# EAGLE design Artembed (EAGLE 9.5.2)
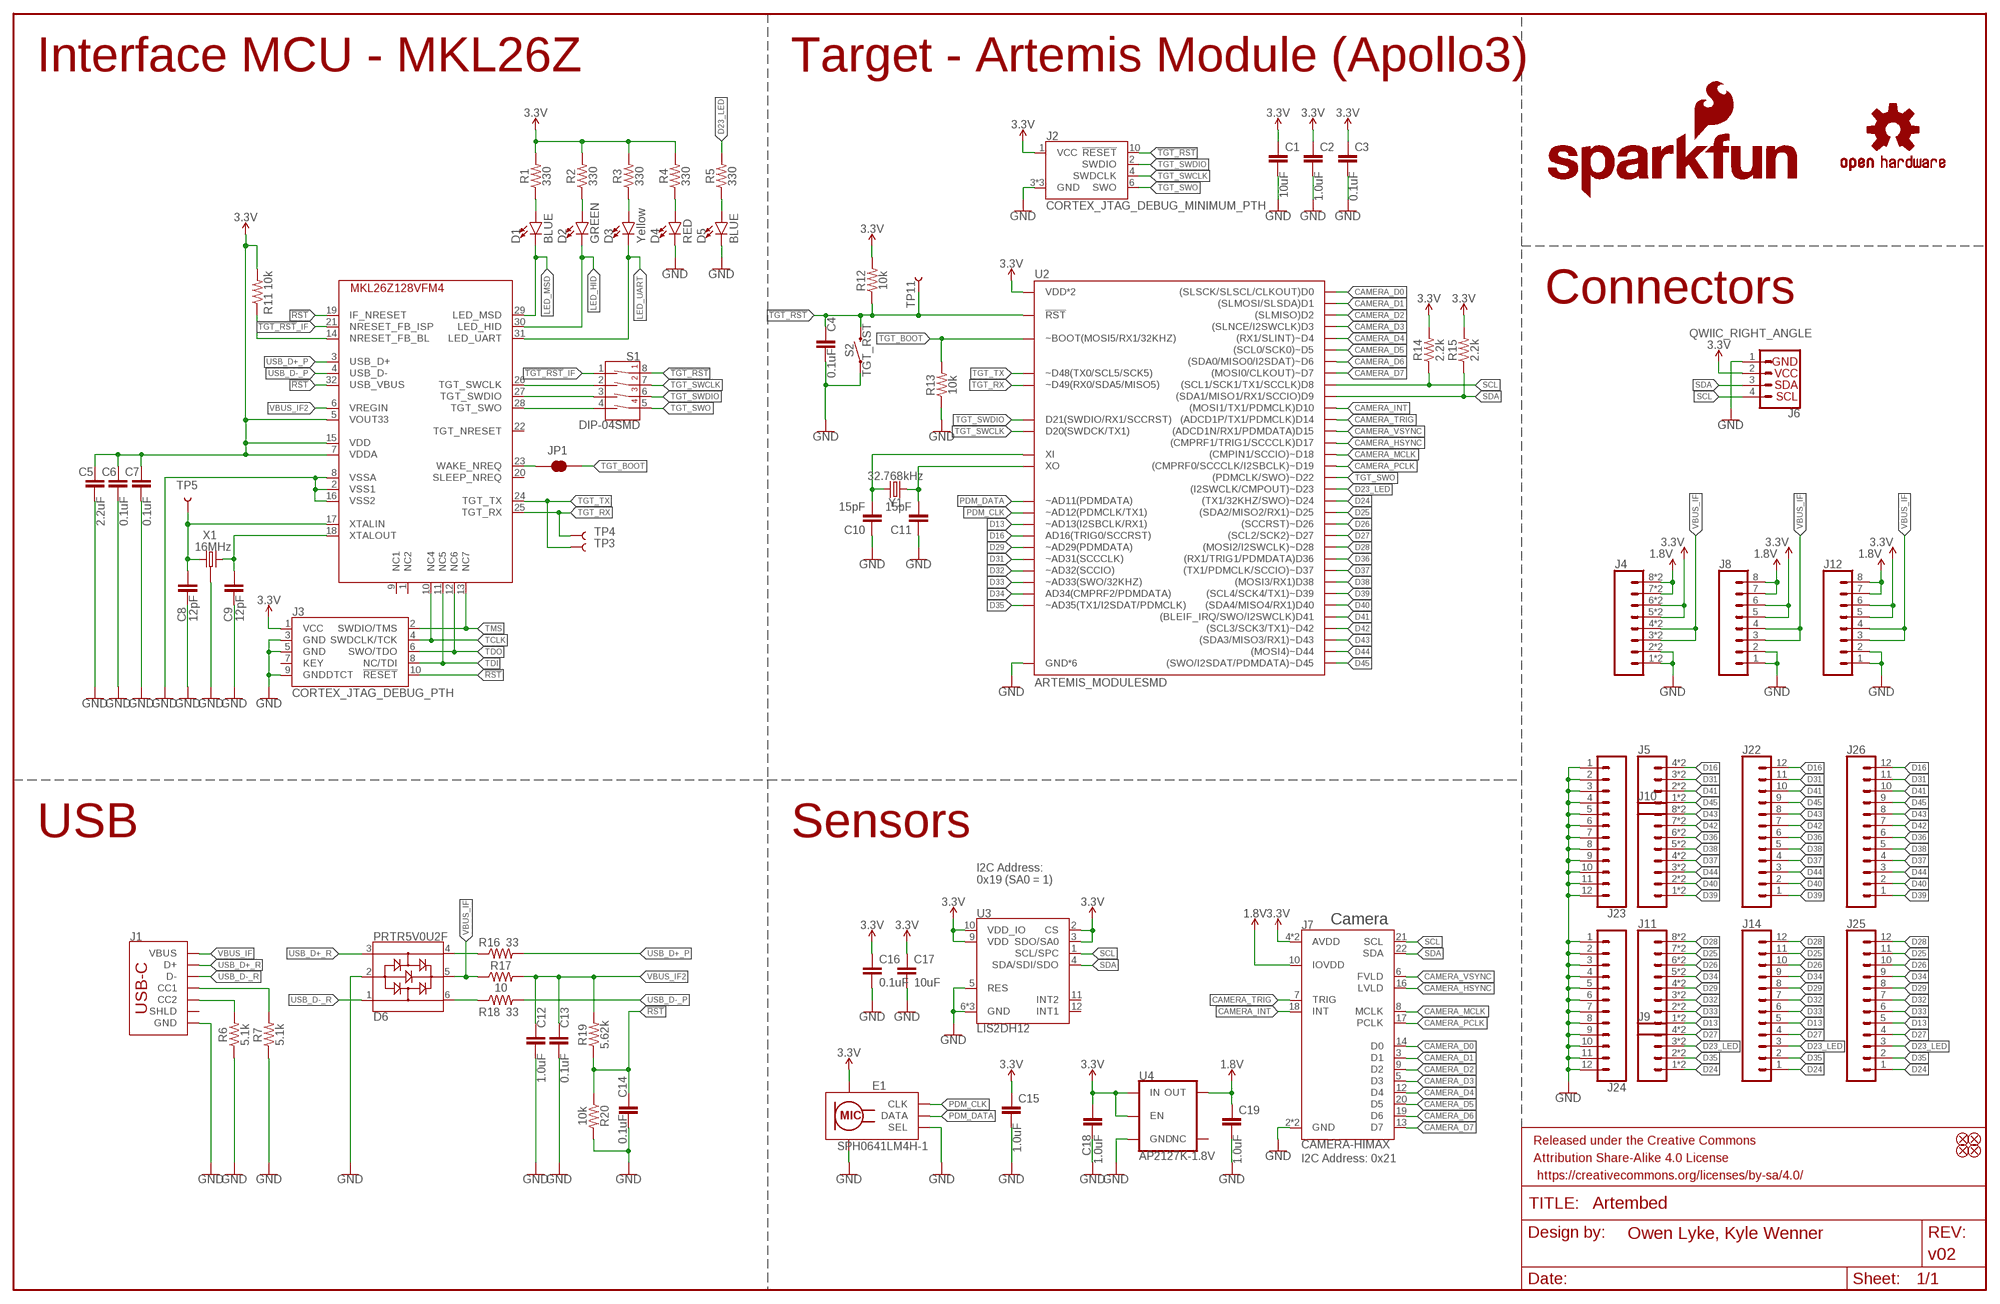
[diagram p0: schematic, sheet 1]

## Parts
C1  10uF  10UF-0603-6.3V-20%  [0603]
C2  1.0uF  1.0UF-0603-16V-10%  [0603]
C3  0.1uF  0.1UF-0603-25V-5%  [0603]
C4  0.1uF  0.1UF-0603-25V-5%  [0603]
C5  2.2uF  2.2UF-0603-10V-20%  [0603]
C6  0.1uF  0.1UF-0603-25V-5%  [0603]
C7  0.1uF  0.1UF-0603-25V-5%  [0603]
C8  12pF  12PF-0603-50V-5%  [0603]
C9  12pF  12PF-0603-50V-5%  [0603]
C10  15pF  15PF-0603-50V-5%  [0603]
C11  15pF  15PF-0603-50V-5%  [0603]
C12  1.0uF  1.0UF-0603-16V-10%  [0603]
C13  0.1uF  0.1UF-0603-25V-5%  [0603]
C14  0.1uF  0.1UF-0603-25V-5%  [0603]
C15  1.0uF  1.0UF-0603-16V-10%  [0603]
C16  0.1uF  0.1UF-0603-25V-5%  [0603]
C17  10uF  10UF-0603-6.3V-20%  [0603]
C18  1.0uF  1.0UF-0603-16V-10%  [0603]
C19  1.0uF  1.0UF-0603-16V-10%  [0603]
D1  BLUE  LED-BLUE0603  [LED-0603]
D2  GREEN  LED-GREEN0603  [LED-0603]
D3  Yellow  LED-YELLOW0603  [LED-0603]
D4  RED  LED-RED0603  [LED-0603]
D5  BLUE  LED-BLUE0603  [LED-0603]
D6  PRTR5V0U2F  [SOT886]
E1  SPH0641LM4H-1  SPH0641LM4H-1_MICROPHONE  [SPH0641LM4H-1_MICROPHONE]
FD1  FIDUCIAL1X2  [FIDUCIAL-1X2]
FD2  FIDUCIAL1X2  [FIDUCIAL-1X2]
FD3  FIDUCIAL1X2  [FIDUCIAL-1X2]
FD4  FIDUCIAL1X2  [FIDUCIAL-1X2]
FRAME1  FRAME-LEDGER  [CREATIVE_COMMONS]
J1  USB_C2-LAYER  [USB-C-16P]
J2  CORTEX_JTAG_DEBUG_MINIMUM_PTH  [2X5-PTH-1.27MM]
J3  CORTEX_JTAG_DEBUG_PTH  [2X5-PTH-1.27MM]
J4  CONN_08SMD-COMBO-FEMALE  [1X08_SMD_COMBINED]
J5  1X04_SMD_STRAIGHT_COMBO  CONN_04SMD_STRAIGHT_COMBO  [1X04_SMD_VERTICAL_COMBO]
J6  QWIIC_RIGHT_ANGLE  QWIIC_CONNECTORJS-1MM  [JST04_1MM_RA]
J7  CAMERA-HIMAX  [FPC-24-AMPHENOL-SFV24R-1STE1HLF]
J8  CONN_08NO_SILK_FEMALE_PTH  [1X08_NO_SILK]
J9  1X04_SMD_STRAIGHT_COMBO  CONN_04SMD_STRAIGHT_COMBO  [1X04_SMD_VERTICAL_COMBO]
J10  CONN_08SMD-COMBO-FEMALE  [1X08_SMD_COMBINED]
J11  CONN_08SMD-COMBO-FEMALE  [1X08_SMD_COMBINED]
J12  CONN_08NO_SILK_FEMALE_PTH  [1X08_NO_SILK]
J14  CONN_12NO_SILK  [1X12_NO_SILK]
J22  CONN_12NO_SILK  [1X12_NO_SILK]
J23  CONN_12NO_SILK  [1X12_NO_SILK]
J24  CONN_12NO_SILK  [1X12_NO_SILK]
J25  CONN_12NO_SILK  [1X12_NO_SILK]
J26  CONN_12NO_SILK  [1X12_NO_SILK]
JP1  JUMPER-SMT_2_NC_TRACE_SILK  [SMT-JUMPER_2_NC_TRACE_SILK]
LOGO1  OSHW-LOGOS  [OSHW-LOGO-S]
LOGO2  SFE_LOGO_NAME_FLAME.2_INCH  [SFE_LOGO_NAME_FLAME_.2]
R1  330  330OHM-0603-1/10W-1%  [0603]
R2  330  330OHM-0603-1/10W-1%  [0603]
R3  330  330OHM-0603-1/10W-1%  [0603]
R4  330  330OHM-0603-1/10W-1%  [0603]
R5  330  330OHM-0603-1/10W-1%  [0603]
R6  5.1k  5.1KOHM5.1KOHM-0603-1/10W-1%  [0603]
R7  5.1k  5.1KOHM5.1KOHM-0603-1/10W-1%  [0603]
R11  10k  10KOHM-0603-1/10W-1%  [0603]
R12  10k  10KOHM-0603-1/10W-1%  [0603]
R13  10k  10KOHM-0603-1/10W-1%  [0603]
R14  2.2k  2.2KOHM-0603-1/10W-1%  [0603]
R15  2.2k  2.2KOHM-0603-1/10W-1%  [0603]
R16  33  33OHM-0603-1/10W-1%  [0603]
R17  10  10OHM-0603-1/10W-1%  [0603]
R18  33  33OHM-0603-1/10W-1%  [0603]
R19  5.62k  5.62KOHM-0603-1/10W-1%  [0603]
R20  10k  10KOHM-0603-1/10W-1%  [0603]
S1  DIP-04SMD  [DIPSWITCH-04-SMD]
S2  TGT_RST  MOMENTARY-SWITCH-SPST-SMD-4.6X2.8MM  [TACTILE_SWITCH_SMD_4.6X2.8MM]
TP3  TEST-POINT3X5  [PAD.03X.05]
TP4  TEST-POINT3X5  [PAD.03X.05]
TP5  TEST-POINT3X5  [PAD.03X.05]
TP11  TEST-POINT3X5  [PAD.03X.05]
U1  DAPLINK_KL26Z  [QFN-32-NOPAD]
U2  ARTEMIS_MODULESMD  [ARTEMIS_FP]
U3  LIS2DH12  [LGA-12-LISDH12]
U4  AP2127K-1.8V  V_REG_AP2127K-1.8V  [SOT23-5]
X1  16MHz  CRYSTAL-16MHZ_SMALL  [CRYSTAL-SMD-2X2.5MM]
Y1  32.768kHz  CRYSTAL-32.768KHZSMD-3.2X1.5  [CRYSTAL-SMD-3.2X1.5MM]

## Nets
1.8V: C19.1 J4.7 J4.7@2 J4.8 J4.8@2 J7.10(IOVDD) J8.7 J8.8 J12.7 J12.8 U4.5(OUT)
3.3V: C1.1 C2.1 C3.1 C5.1 C6.1 C7.1 C15.1 C16.1 C17.1 C18.1 E1.5(VDD) J2.1(VCC) J3.1(VCC) J4.5 J4.5@2 J4.6 J4.6@2 J6.2 J7.4(AVDD) J7.11(AVDD) J8.5 J8.6 J12.5 J12.6 R1.2 R2.2 R3.2 R4.2 R11.2 R12.2 R14.2 R15.2 U1.5(VOUT33) U1.7(VDDA) U1.15(VDD) U2.VDD@36(VDD*2) U2.VDD@37(VDD*2) U3.2(CS) U3.3(SDO/SA0) U3.9(VDD) U3.10(VDD_IO) U4.1(IN) U4.3(EN)
!RST: C14.1 J3.10(!RESET) R19.1 R20.1 U1.19(IF_NRESET) U1.32(USB_VBUS)
!TGT_RST: C4.1 J2.10(!RESET) R12.1 S1.8(1B) S2.3 S2.4 TP11.P$1 U2.~RST(!RST)
!TGT_RST!_IF: S1.1(1A) U1.21(NRESET_FB_ISP)
CAMERA_D0: J7.14(D0) U2.D0((SLSCK/SLSCL/CLKOUT)D0)
CAMERA_D1: J7.3(D1) U2.D1((SLMOSI/SLSDA)D1)
CAMERA_D2: J7.9(D2) U2.D2((SLMISO)D2)
CAMERA_D3: J7.5(D3) U2.D3((SLNCE/I2SWCLK)D3)
CAMERA_D4: J7.12(D4) U2.~D4((RX1/SLINT)~D4)
CAMERA_D5: J7.20(D5) U2.~D5((SCL0/SCK0)~D5)
CAMERA_D6: J7.19(D6) U2.~D6((SDA0/MISO0/I2SDAT)~D6)
CAMERA_D7: J7.13(D7) U2.D7((MOSI0/CLKOUT)~D7)
CAMERA_HSYNC: J7.16(LVLD) U2.D17((CMPRF1/TRIG1/SCCCLK)D17)
CAMERA_INT: J7.18(INT) U2.D10((MOSI1/TX1/PDMCLK)D10)
CAMERA_MCLK: J7.8(MCLK) U2.~D18((CMPIN1/SCCIO)~D18)
CAMERA_PCLK: J7.17(PCLK) U2.~D19((CMPRF0/SCCCLK/I2SBCLK)~D19)
CAMERA_TRIG: J7.7(TRIG) U2.D14((ADCD1P/TX1/PDMCLK)D14)
CAMERA_VSYNC: J7.6(FVLD) U2.D15((ADCD1N/RX1/PDMDATA)D15)
D13: J11.1 J11.1@2 J14.5 J25.5 U2.~AD13(~AD13(I2SBCLK/RX1))
D16: J5.4 J5.4-2 J22.12 J26.12 U2.AD16(AD16(TRIG0/SCCRST))
D23_LED: J9.3 J9.3-2 J14.3 J25.3 R5.2 U2.~D23((I2SWCLK/CMPOUT)~D23)
D24: J9.1 J9.1-2 J14.1 J25.1 U2.~D24((TX1/32KHZ/SWO)~D24)
D25: J11.7 J11.7@2 J14.11 J25.11 U2.~D25((SDA2/MISO2/RX1)~D25)
D26: J11.6 J11.6@2 J14.10 J25.10 U2.~D26((SCCRST)~D26)
D27: J9.4 J9.4-2 J14.4 J25.4 U2.~D27((SCL2/SCK2)~D27)
D28: J11.8 J11.8@2 J14.12 J25.12 U2.~D28((MOSI2/I2SWCLK)~D28)
D29: J11.4 J11.4@2 J14.8 J25.8 U2.~AD29(~AD29(PDMDATA))
D31: J5.3 J5.3-2 J22.11 J26.11 U2.~AD31(~AD31(SCCCLK))
D32: J11.3 J11.3@2 J14.7 J25.7 U2.~AD32(~AD32(SCCIO))
D33: J11.2 J11.2@2 J14.6 J25.6 U2.~AD33/SWO(~AD33(SWO/32KHZ))
D34: J11.5 J11.5@2 J14.9 J25.9 U2.AD34(AD34(CMPRF2/PDMDATA))
D35: J9.2 J9.2-2 J14.2 J25.2 U2.~AD35(~AD35(TX1/I2SDAT/PDMCLK))
D36: J10.6 J10.6@2 J22.6 J26.6 U2.D36((RX1/TRIG1/PDMDATA)D36)
D37: J10.4 J10.4@2 J22.4 J26.4 U2.~D37((TX1/PDMCLK/SCCIO)~D37)
D38: J10.5 J10.5@2 J22.5 J26.5 U2.D38((MOSI3/RX1)D38)
D39: J10.1 J10.1@2 J22.1 J26.1 U2.~D39((SCL4/SCK4/TX1)~D39)
D40: J10.2 J10.2@2 J22.2 J26.2 U2.D40((SDA4/MISO4/RX1)D40)
D41: J5.2 J5.2-2 J22.10 J26.10 U2.D41((BLEIF_IRQ/SWO/I2SWCLK)D41)
D42: J10.7 J10.7@2 J22.7 J26.7 U2.~D42((SCL3/SCK3/TX1)~D42)
D43: J10.8 J10.8@2 J22.8 J26.8 U2.~D43((SDA3/MISO3/RX1)~D43)
D44: J10.3 J10.3@2 J22.3 J26.3 U2.~D44((MOSI4)~D44)
D45: J5.1 J5.1-2 J22.9 J26.9 U2.~D45((SWO/I2SDAT/PDMDATA)~D45)
GND: C1.2 C2.2 C3.2 C4.2 C5.2 C6.2 C7.2 C8.2 C9.2 C10.1 C11.1 C12.2 C13.2 C14.2 C15.2 C16.2 C17.2 C18.2 C19.2 D4.C D5.C D6.2 E1.2(SEL) E1.3(GND) E1.6(GND) E1.7(GND) E1.8(GND) J1.GND J1.GND2(GND) J2.3(GND) J2.5(GND) J2.9(GND) J3.3(GND) J3.5(GND) J3.9(GNDDTCT) J4.1 J4.1@2 J4.2 J4.2@2 J6.1 J7.2(GND) J7.15(GND) J8.1 J8.2 J12.1 J12.2 J23.1 J23.2 J23.3 J23.4 J23.5 J23.6 J23.7 J23.8 J23.9 J23.10 J23.11 J23.12 J24.1 J24.2 J24.3 J24.4 J24.5 J24.6 J24.7 J24.8 J24.9 J24.10 J24.11 J24.12 R6.1 R7.1 R13.1 R20.2 S2.1 S2.2 U1.2(VSS1) U1.8(VSSA) U1.16(VSS2) U2.GND@1(GND*6) U2.GND@22(GND*6) U2.GND@38(GND*6) U2.GND@39(GND*6) U2.GND@47(GND*6) U2.GND@59(GND*6) U3.5(RES) U3.6(GND) U3.7(GND) U3.8(GND) U4.2(GND) X1.P2(GND) X1.P4(GND)
LED_HID: D2.C U1.30(LED_HID)
LED_MSD: D1.C U1.29(LED_MSD)
LED_UART: D3.C U1.31(LED_UART)
N$1: D1.A R1.1
N$2: D2.A R2.1
N$3: D3.A R3.1
N$4: J1.B5(CC2) R6.2
N$5: J1.A5(CC1) R7.2
N$6: D5.A R5.1
N$7: D4.A R4.1
N$8: D6.4 R16.1
N$9: D6.6 R18.1
N$10: R11.1 U1.14(NRESET_FB_BL)
N$11: JP1.1 U1.23(WAKE_NREQ)
N$12: S1.4(4A) U1.28(TGT_SWO)
N$13: C8.1 TP5.P$1 U1.17(XTALIN) X1.P1
N$14: C10.2 U2.XI Y1.P$2
N$15: C11.2 U2.XO Y1.P$1
N$16: C9.1 U1.18(XTALOUT) X1.P3
N$17: S1.3(3A) U1.27(TGT_SWDIO)
N$18: S1.2(2A) U1.26(TGT_SWCLK)
PDM_CLK: E1.4(CLK) U2.~AD12(~AD12(PDMCLK/TX1))
PDM_DATA: E1.1(DATA) U2.~AD11(~AD11(PDMDATA))
SCL: J6.4 J7.21(SCL) R14.1 U2.D8((SCL1/SCK1/TX1/SCCLK)D8) U3.1(SCL/SPC)
SDA: J6.3 J7.22(SDA) R15.1 U2.D9((SDA1/MISO1/RX1/SCCIO)D9) U3.4(SDA/SDI/SDO)
TCLK: J3.4(SWDCLK/TCK) U1.10(NC4)
TDI: J3.8(NC/TDI) U1.11(NC5)
TDO: J3.6(SWO/TDO) U1.12(NC6)
TGT_BOOT: JP1.2 R13.2 U2.BOOT(~BOOT(MOSI5/RX1/32KHZ))
TGT_RX: TP4.P$1 U1.25(TGT_RX) U2.RXI-0(~D49(RX0/SDA5/MISO5))
TGT_SWCLK: J2.4(SWDCLK) S1.7(2B) U2.SWDCK(D20(SWDCK/TX1))
TGT_SWDIO: J2.2(SWDIO) S1.6(3B) U2.SWDIO(D21(SWDIO/RX1/SCCRST))
TGT_SWO: J2.6(SWO) S1.5(4B) U2.~D22((PDMCLK/SWO)~D22)
TGT_TX: TP3.P$1 U1.24(TGT_TX) U2.TXO-0(~D48(TX0/SCL5/SCK5))
TMS: J3.2(SWDIO/TMS) U1.13(NC7)
USB_D+_P: R16.2 U1.3(USB_D+)
USB_D+_R: D6.3 J1.A6(D+) J1.B6(D+)
USB_D-_P: R18.2 U1.4(USB_D-)
USB_D-_R: D6.1 J1.A7(D-) J1.B7(D-)
VBUS_IF: D6.5 J1.VBUS1(VBUS) J1.VBUS2(VBUS) J4.3 J4.3@2 J4.4 J4.4@2 J8.3 J8.4 J12.3 J12.4 R17.1
VBUS_IF2: C12.1 C13.1 R17.2 R19.2 U1.6(VREGIN)
Unconnected: J1.SHLD1(SHLD) J1.SHLD2(SHLD) J1.SHLD3(SHLD) J1.SHLD4(SHLD) J1.SHLD5(SHLD) J1.SHLD6(SHLD) J1.SHLD7(SHLD) J1.SHLD8(SHLD) J3.7(KEY) J7.MNT1@0(MNT1) J7.MNT1@1(MNT1) J7.MNT2@0(MNT2) J7.MNT2@1(MNT2) U1.1(NC2) U1.9(NC1) U1.20(SLEEP_NREQ) U1.22(TGT_NRESET) U3.11(INT2) U3.12(INT1) U4.4(NC)

## Notes on the sheet
- Interface MCU - MKL26Z | Target - Artemis Module (Apollo3)
- Connectors
- USB | Sensors
- I2C Address:
  0x19 (SA0 = 1)
- Camera
- I2C Address: 0x21

## Library data of the parts
C1 C17 = SparkFun-Capacitors:10UF: 10.0µF ceramic capacitors A capacitor is a passive two-terminal electrical component used to store electrical energy temporarily in an electric field.; PROD_ID: CAP-11015
C2 C12 C15 C18 C19 = SparkFun-Capacitors:1.0UF: 1µF ceramic capacitors A capacitor is a passive two-terminal electrical component used to store electrical energy temporarily in an electric field.; PROD_ID: CAP-00868
C3 C4 C6 C7 C13 C14 C16 = SparkFun-Capacitors:0.1UF: 0.1µF ceramic capacitors A capacitor is a passive two-terminal electrical component used to store electrical energy temporarily in an electric field.; PROD_ID: CAP-08604
C5 = SparkFun-Capacitors:2.2UF: 2.2µF ceramic capacitors A capacitor is a passive two-terminal electrical component used to store electrical energy temporarily in an electric field.; PROD_ID: CAP-07888
C8 C9 = SparkFun-Capacitors:12PF: 12pF ceramic capacitors A capacitor is a passive two-terminal electrical component used to store electrical energy temporarily in an electric field.; PROD_ID: CAP-09137
C10 C11 = SparkFun-Capacitors:15PF: 15pF ceramic capacitors A capacitor is a passive two-terminal electrical component used to store electrical energy temporarily in an electric field.; PROD_ID: CAP-07881
D1 D5 = SparkFun-LED:LED-BLUE: Blue SMD LED Used in manufacturing of various products at SparkFun Packages: 0603 - SMD 0603 package [Product Link] <http://www.digikey.com/product-detail/en/SMLE12BC7TT86/511-1589-2-ND/1641808> 1206 - SMD1206 package [Product Link] <http://www.digikey.com/product-detail/en/lite-on-inc/LTST-C150TBKT/160-1643-1-ND/573584> SparkFun Products: ESP8266 Thing-Dev Board <https://www.sparkfun.com/products/13711> RedBoard <https://www.sparkfun.com/products/12757>; PROD_ID: DIO-08575
D2 = SparkFun-LED:LED-GREEN: Green SMD LED Used in manufacturing of various products at SparkFun Packages: 0603 - SMD 0603 package [Product Link] <http://www.futureelectronics.com/en/technologies/semiconductors/optoelectronics/leds/Pages/9894312-LTST-C190GKT.aspx?CrossPart=HSMG-C190&IM=0> LilyPad 1206 - SMD1206 LilyPad package [Product Link] <http://www.futureelectronics.com/en/Technologies/Product.aspx?ProductID=IN150NGHARVATEKCORPORATION2049943&IM=0> 1206 - SMD1206 package [Product Link] <http://www.futureelectronics.com/en/technologies/semiconductors/optoelectronics/leds/Pages/8315665-LTST-C150KGKT.aspx?IM=0> 1206 Bottom Mount -SMD 1206 Bottom Mount [Product Link] <http://www.digikey.com/product-detail/en/lite-on-inc/LTST-C230KGKT/160-1456-1-ND/386854> SparkFun Products: Pro Mini 328 -5V <https://www.sparkfun.com/products/821> RedBoard <https://www.sparkfun.com/products/12757> MP3 Trigger <https://www.sparkfun.com/products/13720> Makey Makey <https://www.sparkfun.com/products/11076>; PROD_ID: DIO-00821
D3 = SparkFun-LED:LED-YELLOW: Yellow SMD LED Used in manufacturing several products at SparkFun. Packages: 0603 - SMD 0603 package[Product Link] <http://www.kingbrightusa.com/product.asp?catalog_name=LED&product_id=APT1608SYCK> 0603 -SMART - SMART SMD 0603 package (more efficient/more expensive) [Product Link] <http://www.osram-os.com/osram_os/en/products/product-catalog/led-light-emitting-diodes/smartled-0603/ly-l29k/index.jsp> LilyPad - SMD1206 package[Product Datasheet] <https://www.sparkfun.com/datasheets/DevTools/LilyPad/Q150YUS4.pdf> SparkFun Products: Blynk Board <https://www.sparkfun.com/products/13794> IOIO-OTG <https://www.sparkfun.com/products/13613> XBee Explorer Serial <https://www.sparkfun.com/products/13225>; PROD_ID: DIO-09003
D4 = SparkFun-LED:LED-RED: Red SMD LED Used in manufacturing of most products at SparkFun Packages: 0603 - SMD 0603 package [Product Link] <http://docs.avagotech.com/docs/AV02-0551EN> 0603 SMART - SMD 0603 SMART package ( more efficient and expensive)[Product Link] <http://www.osram-os.com/Graphics/XPic2/00077099_0.pdf> 1206 - SMD1206 package [Product Link] <https://www.sparkfun.com/datasheets/DevTools/LilyPad/Q150OVS4.pdff> SparkFun Products: Pro Mini 328 -5V <https://www.sparkfun.com/products/821> RedBoard <https://www.sparkfun.com/products/12757> IOIO-OTG <https://www.sparkfun.com/products/13613>; PROD_ID: DIO-00819
D6 = SparkFun-IC-Power:PRTR5V0U2: A small ESD protection device. Most commonly used on USB D+/D- signals to protect large, expensive, or especially sensitive USB enabled devices.; PROD_ID: DIO-14084
E1 = SparkFun-Sensors:SPH0641LM4H-1_MICROPHONE: SPH0641LM4H-1 Microphone A miniature, high-performance, low power, bottom port silicon digital microphone with a single bit PDM output.; PROD_ID: IC-14361
FD1-FD4 = SparkFun-Aesthetics:FIDUCIAL: Fiducial Alignment Points Point-of-reference for pick-and-place machines and other optical instruments.
FRAME1 = SparkFun-Aesthetics:FRAME-LEDGER: Schematic Frame - Ledger Standard 11x14 US Ledger frame; DESIGNER: Owen Lyke, Kyle Wenner; REV: v02
J1 = SparkFun-Connectors:USB_C: USB Type C 16Pin Connector Super Speed pins not available on the 16-pin purely SMD connector so this part is best for USB 2.0 implementations. D1 and D2 are tied together enabling D+/- no matter which way the cable is plugged into the connector. The two channel configuration pins (CC1/2) are exposed. These are normally connected to ground via 5.1k resistors but can be reconfigured for high current/high power applications.; PROD_ID: CONN-14122
J2 = SparkFun-Connectors:CORTEX_JTAG_DEBUG_MINIMUM: Cortex Debug Connector - 10 pin Supports JTAG debug, Serial Wire debug, and Serial Wire Viewer. PTH and SMD connector options available. General Connector Information <http://infocenter.arm.com/help/topic/com.arm.doc.faqs/attached/13634/cortex_debug_connectors.pdf> Products: PTH Connector <http://www.digikey.com/product-detail/en/cnc-tech/3220-10-0100-00/1175-1627-ND/3883661> -via Digi-Key SparkFun PSoc <https://www.sparkfun.com/products/13229> SparkFun T <https://www.sparkfun.com/products/13810>
J3 = SparkFun-Connectors:CORTEX_JTAG_DEBUG: Cortex Debug Connector - 10 pin Supports JTAG debug, Serial Wire debug, and Serial Wire Viewer. PTH and SMD connector options available. General Connector Information <http://infocenter.arm.com/help/topic/com.arm.doc.faqs/attached/13634/cortex_debug_connectors.pdf> Products: PTH Connector <http://www.digikey.com/product-detail/en/cnc-tech/3220-10-0100-00/1175-1627-ND/3883661> -via Digi-Key SparkFun PSoc <https://www.sparkfun.com/products/13229> SparkFun T <https://www.sparkfun.com/products/13810>
J4 J10 J11 = SparkFun-Connectors:CONN_08: Multi connection point. Often used as Generic Header-pin footprint for 0.1 inch spaced/style header connections On any of the 0.1 inch spaced packages, you can populate with these: Break Away Headers - Straight <https://www.sparkfun.com/products/116> (PRT-00116) Break Away Male Headers - Right Angle <https://www.sparkfun.com/products/553> (PRT-00553) Female Headers <https://www.sparkfun.com/products/115> (PRT-00115) Break Away Headers - Machine Pin <https://www.sparkfun.com/products/117> (PRT-00117) Break Away Female Headers - Swiss Machine Pin <https://www.sparkfun.com/products/743> (PRT-00743) Arduino Stackable Header - 8 Pin <https://www.sparkfun.com/products/9279> (PRT-09279) For SCREWTERMINALS and SPRING TERMINALS visit here: Screw Terimnals on SparkFun.com <https://www.sparkfun.com/search/results?term=Screw+Terminals> (5mm/3.5mm/2.54mm spacing) This device is also useful as a general connection point to wire up your design to another part of your project. Our various solder wires solder well into these plated through hole pads. Hook-Up Wire - Assortment (Stranded, 22 AWG) <https://www.sparkfun.com/products/11375> (PRT-11375) Hook-Up Wire - Assortment (Solid Core, 22 AWG) <https://www.sparkfun.com/products/11367> (PRT-11367) View the entire wire category on our website here <https://www.sparkfun.com/categories/141> Special notes: Molex polarized connector foot print use with SKU : PRT-08231 with associated crimp pins and housings. 1MM SMD Version SKU: PRT-10208 NOTES ON THE VARIANTS LOCK and LOCK_LONGPADS... This footprint was designed to help hold the alignment of a through-hole component (i.e. 6-pin header) while soldering it into place. You may notice that each hole has been shifted either up or down by 0.005 of an inch from it's more standard position (which is a perfectly straight line). This slight alteration caused the pins (the squares in the middle) to touch the edges of the holes. Because they are alternating, it causes a "brace" to hold the component in place. 0.005 has proven to be the perfect amount of "off-center" position when using our standard breakaway headers. Although looks a little odd when you look at the bare footprint, once you have a header in there, the alteration is very hard to notice. Also,if you push a header all the way into place, it is covered up entirely on the bottom side.; PROD_ID: CONN-10204; SF_ID: PRT-11543
J5 J9 = SparkFun-Connectors:CONN_04: Multi connection point. Often used as Generic Header-pin footprint for 0.1 inch spaced/style header connections On any of the 0.1 inch spaced packages, you can populate with these: Break Away Headers - Straight <https://www.sparkfun.com/products/116> (PRT-00116) Break Away Male Headers - Right Angle <https://www.sparkfun.com/products/553> (PRT-00553) Female Headers <https://www.sparkfun.com/products/115> (PRT-00115) Break Away Headers - Machine Pin <https://www.sparkfun.com/products/117> (PRT-00117) Break Away Female Headers - Swiss Machine Pin <https://www.sparkfun.com/products/743> (PRT-00743) For SCREWTERMINALS and SPRING TERMINALS visit here: Screw Terimnals on SparkFun.com <https://www.sparkfun.com/search/results?term=Screw+Terminals> (5mm/3.5mm/2.54mm spacing) This device is also useful as a general connection point to wire up your design to another part of your project. Our various solder wires solder well into these plated through hole pads. Hook-Up Wire - Assortment (Stranded, 22 AWG) <https://www.sparkfun.com/products/11375> (PRT-11375) Hook-Up Wire - Assortment (Solid Core, 22 AWG) <https://www.sparkfun.com/products/11367> (PRT-11367) View the entire wire category on our website here <https://www.sparkfun.com/categories/141> Special notes: Molex polarized connector foot print use with SKU : PRT-08231 with associated crimp pins and housings. 1MM SMD Version SKU: PRT-10208; PROD_ID: CONN-08511
J6 = SparkFun-Connectors:QWIIC_CONNECTOR: SparkFun I2C Standard Qwiic Connector An SMD 1mm pitch JST connector makes it easy and quick (get it? Qwiic?) to connect I2C devices to each other. The Qwiic system <http://www.sparkfun.com/qwiic> enables fast and solderless connection between popular platforms and various sensors and actuators. We carry 200mm <https://www.sparkfun.com/products/14204>, 100mm <https://www.sparkfun.com/products/14205>, 50mm <https://www.sparkfun.com/products/14206>, and breadboard friendly <https://www.sparkfun.com/products/14207> Qwiic cables. We also offer 10 pcs strips <https://www.sparkfun.com/products/14323> the SMD connectors.; PROD_ID: CONN-13694
J7 = SparkFun-Connectors:CAMERA-HIMAX; DIGIKEY: 609-4320-2-ND; PROD_ID: CONN-14233
J8 J12 = SparkFun-Connectors:CONN_08: Multi connection point. Often used as Generic Header-pin footprint for 0.1 inch spaced/style header connections On any of the 0.1 inch spaced packages, you can populate with these: Break Away Headers - Straight <https://www.sparkfun.com/products/116> (PRT-00116) Break Away Male Headers - Right Angle <https://www.sparkfun.com/products/553> (PRT-00553) Female Headers <https://www.sparkfun.com/products/115> (PRT-00115) Break Away Headers - Machine Pin <https://www.sparkfun.com/products/117> (PRT-00117) Break Away Female Headers - Swiss Machine Pin <https://www.sparkfun.com/products/743> (PRT-00743) Arduino Stackable Header - 8 Pin <https://www.sparkfun.com/products/9279> (PRT-09279) For SCREWTERMINALS and SPRING TERMINALS visit here: Screw Terimnals on SparkFun.com <https://www.sparkfun.com/search/results?term=Screw+Terminals> (5mm/3.5mm/2.54mm spacing) This device is also useful as a general connection point to wire up your design to another part of your project. Our various solder wires solder well into these plated through hole pads. Hook-Up Wire - Assortment (Stranded, 22 AWG) <https://www.sparkfun.com/products/11375> (PRT-11375) Hook-Up Wire - Assortment (Solid Core, 22 AWG) <https://www.sparkfun.com/products/11367> (PRT-11367) View the entire wire category on our website here <https://www.sparkfun.com/categories/141> Special notes: Molex polarized connector foot print use with SKU : PRT-08231 with associated crimp pins and housings. 1MM SMD Version SKU: PRT-10208 NOTES ON THE VARIANTS LOCK and LOCK_LONGPADS... This footprint was designed to help hold the alignment of a through-hole component (i.e. 6-pin header) while soldering it into place. You may notice that each hole has been shifted either up or down by 0.005 of an inch from it's more standard position (which is a perfectly straight line). This slight alteration caused the pins (the squares in the middle) to touch the edges of the holes. Because they are alternating, it causes a "brace" to hold the component in place. 0.005 has proven to be the perfect amount of "off-center" position when using our standard breakaway headers. Although looks a little odd when you look at the bare footprint, once you have a header in there, the alteration is very hard to notice. Also,if you push a header all the way into place, it is covered up entirely on the bottom side.; PROD_ID: CONN-08438
J14 J22-J26 = SparkFun-Connectors:CONN_12: Multi connection point. Often used as Generic Header-pin footprint for 0.1 inch spaced/style header connections On any of the 0.1 inch spaced packages, you can populate with these: Break Away Headers - Straight <https://www.sparkfun.com/products/116> (PRT-00116) Break Away Male Headers - Right Angle <https://www.sparkfun.com/products/553> (PRT-00553) Female Headers <https://www.sparkfun.com/products/115> (PRT-00115) Break Away Headers - Machine Pin <https://www.sparkfun.com/products/117> (PRT-00117) Break Away Female Headers - Swiss Machine Pin <https://www.sparkfun.com/products/743> (PRT-00743) For SCREWTERMINALS and SPRING TERMINALS visit here: Screw Terimnals on SparkFun.com <https://www.sparkfun.com/search/results?term=Screw+Terminals> (5mm/3.5mm/2.54mm spacing) This device is also useful as a general connection point to wire up your design to another part of your project. Our various solder wires solder well into these plated through hole pads. Hook-Up Wire - Assortment (Stranded, 22 AWG) <https://www.sparkfun.com/products/11375> (PRT-11375) Hook-Up Wire - Assortment (Solid Core, 22 AWG) <https://www.sparkfun.com/products/11367> (PRT-11367) View the entire wire category on our website here <https://www.sparkfun.com/categories/141> Special notes: Molex polarized connector foot print use with SKU : PRT-08231 with associated crimp pins and housings. 1MM SMD Version SKU: PRT-10208 NOTES ON THE VARIANTS LOCK and LOCK_LONGPADS... This footprint was designed to help hold the alignment of a through-hole component (i.e. 6-pin header) while soldering it into place. You may notice that each hole has been shifted either up or down by 0.005 of an inch from it's more standard position (which is a perfectly straight line). This slight alteration caused the pins (the squares in the middle) to touch the edges of the holes. Because they are alternating, it causes a "brace" to hold the component in place. 0.005 has proven to be the perfect amount of "off-center" position when using our standard breakaway headers. Although looks a little odd when you look at the bare footprint, once you have a header in there, the alteration is very hard to notice. Also,if you push a header all the way into place, it is covered up entirely on the bottom side.
JP1 = SparkFun-Jumpers:JUMPER-SMT_2_NC_TRACE: Normally closed trace jumper This jumper has a trace between two pads so it's normally closed (NC). Use a razor knife to open the connection. For best results follow the IPC guidelines for cutting traces: Cutout at least 0.063 mm (0.005 in). Remove all loose material to clean up the cut area. Seal the cut with an approved epoxy. Reapply solder to reclose the connection.
LOGO1 = SparkFun-Aesthetics:OSHW-LOGO: Open-Source Hardware (OSHW) Logo This logo indicates the piece of hardware it is found on incorporates a OSHW license and/or adheres to the definition of open source hardware found here: http://freedomdefined.org/OSHW
LOGO2 = SparkFun-Aesthetics:SFE_LOGO_NAME_FLAME: SparkFun Font Logo w/ Flame This is the SparkFun full logo. The logo on the schematic will always be the same size; the package variant is the height of the flame part of the logo. Default layer for the logo on the board is tSilk.
R1-R5 = SparkFun-Resistors:330OHM: 330Ω resistor A resistor is a passive two-terminal electrical component that implements electrical resistance as a circuit element. Resistors act to reduce current flow, and, at the same time, act to lower voltage levels within circuits. - Wikipedia; PROD_ID: RES-00818
R6 R7 = SparkFun-Resistors:5.1KOHM; PROD_ID: RES-12083
R11-R13 R20 = SparkFun-Resistors:10KOHM: 10kΩ resistor A resistor is a passive two-terminal electrical component that implements electrical resistance as a circuit element. Resistors act to reduce current flow, and, at the same time, act to lower voltage levels within circuits. - Wikipedia; PROD_ID: RES-00824
R14 R15 = SparkFun-Resistors:2.2KOHM: 2.2kΩ resistor A resistor is a passive two-terminal electrical component that implements electrical resistance as a circuit element. Resistors act to reduce current flow, and, at the same time, act to lower voltage levels within circuits. - Wikipedia; PROD_ID: RES-08272
R16 R18 = SparkFun-Resistors:33OHM: 33Ω resistor A resistor is a passive two-terminal electrical component that implements electrical resistance as a circuit element. Resistors act to reduce current flow, and, at the same time, act to lower voltage levels within circuits. - Wikipedia; PROD_ID: RES-08270
R17 = SparkFun-Resistors:10OHM: 10Ω resistor A resistor is a passive two-terminal electrical component that implements electrical resistance as a circuit element. Resistors act to reduce current flow, and, at the same time, act to lower voltage levels within circuits. - Wikipedia; PROD_ID: RES-12581
R19 = SparkFun-Resistors:5.62KOHM: 5.62kΩ resistor A resistor is a passive two-terminal electrical component that implements electrical resistance as a circuit element. Resistors act to reduce current flow, and, at the same time, act to lower voltage levels within circuits. - Wikipedia; PROD_ID: RES-09823
S1 = SparkFun-Switches:DIP-04: 4-Position DIP Switch 4-circuit DIP (dual inline package) switch. Commonly used to physcially set a circuit's behavior. SparkFun Products Prototype Part; PROD_ID: SWCH-12418
S2 = SparkFun-Switches:MOMENTARY-SWITCH-SPST: Momentary Switch (Pushbutton) - SPST Normally-open (NO) SPST momentary switches (buttons, pushbuttons). Variants PTH-12MM - 12mm square, through-hole Momentary Pushbutton Switch - 12mm Square <https://www.sparkfun.com/products/9190> (COM-09190) PTH-6.0MM, PTH-6.0MM-KIT - 6.0mm square, through-hole Mini Pushbutton Switch <https://www.sparkfun.com/products/97> (COM-00097) KIT package intended for soldering kit's - only one side of pads' copper is exposed. PTH-RIGHT-ANGLE-KIT - Right-angle, through-hole Right Angle Tactile Button <https://www.sparkfun.com/products/10791> - Used on SparkFun BigTime Watch Kit <https://www.sparkfun.com/products/11734> SMD-12MM - 12mm square, surface-mount Tactile Button - SMD (12mm) <https://www.sparkfun.com/products/12993> (COM-12993) Used on SparkFun PicoBoard <https://www.sparkfun.com/products/11888> SMD-4.5MM - 4.5mm Square Trackball Switch Used on SparkFun Blackberry Trackballer Breakout <https://www.sparkfun.com/products/13169> SMD-4.6MMX2.8MM - 4.60mm x 2.80mm, surface mount Used on SparkFun SAMD21 Mini Breakout <https://www.sparkfun.com/products/13664> SMD-5.2MM, SMD-5.2-REDUNDANT - 5.2mm square, surface-mount Mini Pushbutton Switch - SMD <https://www.sparkfun.com/products/8720> (COM-08720) Used on Arduino Pro Mini <https://www.sparkfun.com/products/11114> REDUNDANT package connects both switch circuits together SMD-6.0X3.5MM - 6.0 x 3.5mm, surface mount Momentary Reset Switch SMD <https://www.sparkfun.com/products/8229> (COM-08229) SMD-6.2MM-TALL - 6.2mm square, surface mount Tactile Button - SMD (6mm) <https://www.sparkfun.com/products/12992> Used on SparkFun Digital Sandbox <https://www.sparkfun.com/products/12651> SMD-RIGHT-ANGLE - Right-angle, surface mount Used on SparkFun Block for Intel® Edison - Arduino <https://www.sparkfun.com/products/13036>; PROD_ID: SWCH-13065
TP3-TP5 TP11 = SparkFun-Connectors:TEST-POINT: SparkFun Test Points Bare copper test points for troubleshooting or In-Circuit-Testing. These are used by our Production team for verifying production board runs using pogo-pins on test beds. SparkFun Products: SparkFun LSM9DS1 Breakout <https://www.sparkfun.com/products/13284> SparkFun PSOC <https://www.sparkfun.com/products/13714> SparkFun Load Cell Amplifier <https://www.sparkfun.com/products/13879>
U1 = artembed:DAPLINK_KL26Z: Unfinished! This is an interface MCU that runs DAPLink to enable advanced features for the target MCU
U2 = SparkFun-IC-Microcontroller:ARTEMIS_MODULE: Description: The Artemis Module from SparkFun is a Cortex-M4F with BLE 5.0 running up to 96MHz and with as low power as 6uA per MHz (less than 5mW). This is the world's first module to bridge the market between hobbyists and consumer products. We've packaged all the power of a modern microcontroller into a module that is both extremely easy to use but is mass-market ready. The flexibility of the Artemis module starts with our [Arduino core](https://github.com/sparkfun/Arduino_Apollo3). You can program and use the Artemis module just like you would an Uno or any other Arduino. Time to first blink is just 5 minutes away! We built the core from the ground up, making it fast and as light weight as possible.; PROD_ID: SUB-14402
U3 = SparkFun-Sensors:LIS2DH12; DIGIKEY: 497-14851-2-ND; PROD_ID: IC-14229
U4 = SparkFun-IC-Power:V_REG_AP2127: AP2127 - 300mA CMOS LDO Regulator w/ Enable The AP2127 is CMOS process low dropout linear regulator with enable function, the regulator delivers a guaranteed 300mA (min.) continuous load current. Features Output Voltage Accuracy: ±1.5% Output Current: 300mA (Min.) Foldback Short Current Protection: 50mA Enable Function to Turn ON/OFF VOUT Low Dropout Voltage (3.3V): 250mV (Typ.) @IOUT=600mA Excellent Load Regulation: 0.2%/A (Typ.) Excellent Line Regulation: 0.02%/V (Typ.) Low Quiescent Current: 55μA (Typ.) Low Standby Current: 0.01μA (Typ.) Low Output Noise: 50μVRMS PSRR: 100Hz -65dB, 1kHz -65dB OTSD Protection Stable with 1.0μF Flexible Cap: Ceramic, Tantalum and Aluminum Electrolytic Operation Temperature Range: -40°C to 85°C ESD: MM 400V, HBM 4000V; PROD_ID: VREG-14239
X1 = SparkFun-Clocks:CRYSTAL-16MHZ_SMALL: 16 MHz Crystal Digikey Link <https://www.digikey.com/product-detail/en/epson/FA-20H-16.0000MF10Z-AJ5/SER4201TR-ND/7430936> Crystal Attributes: Frequency: 16 MHz Frequency Stability: +/- 10ppm Frequency Tolerance: +/- 10ppm Load Capacitance: 8pF ESR: 80 Ohms Operating Mode: Fundamental PAD 2 and PAD 4 are GROUNDED; PROD_ID: XTAL-14664
Y1 = SparkFun-Clocks:CRYSTAL-32.768KHZ: 32.768kHz Crystal Frequency: 32.768kHz Frequency Stability: ±20ppm Load Capacitance: 12.5pF (PTH-2X6 & SMD-3.2X1.5), 6pF (SMD-2X6) SparkFun Products: SparkFun BigTime Watch Kit <https://www.sparkfun.com/products/11734> SparkFun nRF52832 Breakout <https://www.sparkfun.com/products/13990> SparkFun Real Time Clock Module <https://www.sparkfun.com/products/12708>; PROD_ID: XTAL-13062

## Board
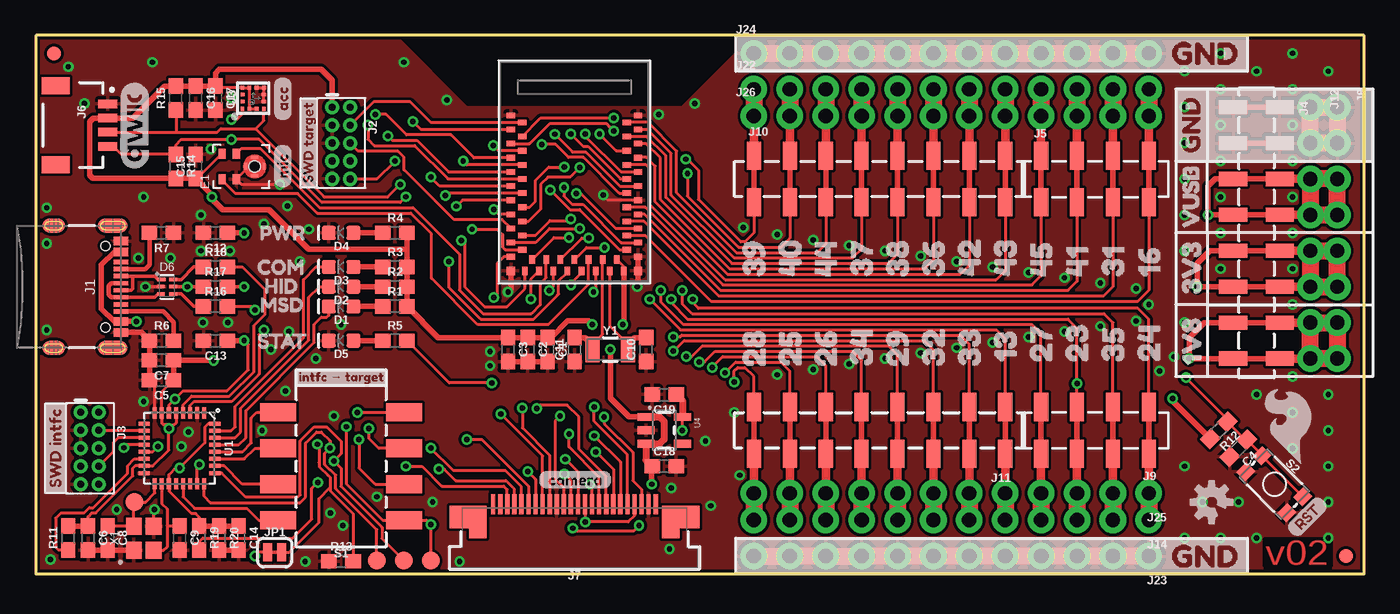
[diagram p1: board, top side]
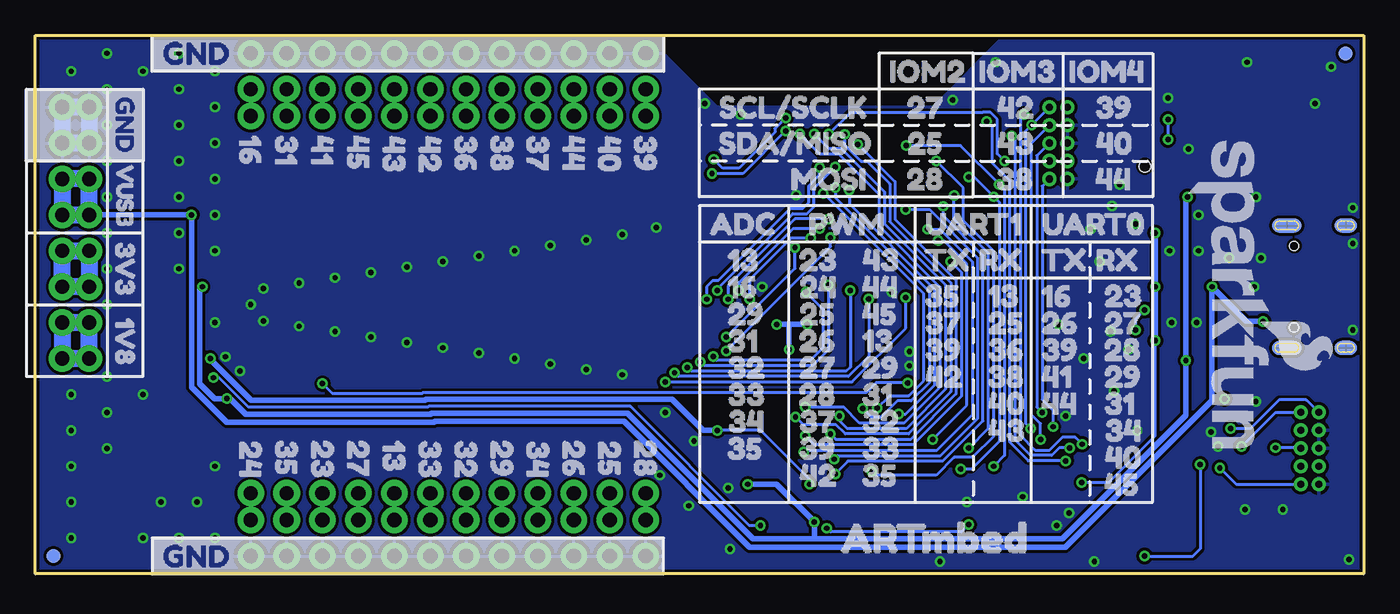
[diagram p2: board, bottom side, seen from below]

Size 93.98 x 38.1 mm. Coordinates in mm from the lower left corner, seen from the top.
Outline: 0,0 93.98,0 93.98,38.1 0,38.1 0,0
Copper layers (1*16): Top 0.035mm / dielectric 1.5mm / Bottom 0.035mm
Design rules "SparkFun-2-layer-TIGHT": minimum track width 7mil, minimum drill 15mil, track to track 7mil, track to pad 7mil, pad to pad 7mil, via to via 7mil, smd to smd 7mil, copper to edge 7mil, drill to drill 7mil, minimum pad ring 7mil, minimum via ring 7mil, stop-mask expansion 4mil, vias tented up to drill 25mil, thermal gap 10mil

### Footprints (pad centres in the part's own frame; a part is rotated, then mirrored left to right if it is on the bottom)
0603 = smd 1.1 x 1: 1 -0.85,0; 2 0.85,0
LED-0603 = smd 1 x 1: A -0.877,0; C 0.877,0
SOT886 = smd 0.61 x 0.25: 1 -0.405,0.5 | smd 0.56 x 0.25: 2 -0.43,0; 3 -0.43,-0.5; 4 0.43,-0.5; 5 0.43,0; 6 0.43,0.5
SPH0641LM4H-1_MICROPHONE = smd 0.725 x 0.522: 1 -0.9,1.3; 2 -0.9,0.3; 4 0.9,0.3; 5 0.9,1.3 | smd 0.5 x 0.2: 3 0,-1.65; 8 0,-0.35 | smd 0.2 x 0.5: 6 -0.65,-1; 7 0.65,-1 | hole 0.8: 0,-1
FIDUCIAL-1X2 = smd 1 x 1: 1 0,0
USB-C-16P = smd 0.3 x 1: A5 -1.25,-0.34; A6 -0.25,-0.34; A7 0.25,-0.34; A8 1.25,-0.34; B5 1.75,-0.34; B6 0.75,-0.34; B7 -0.75,-0.34; B8 -1.75,-0.34 | smd 0.6 x 1: GND -3.225,-0.34; GND2 3.225,-0.34; VBUS1 -2.45,-0.34; VBUS2 2.45,-0.34 | smd 1 x 2.1: SHLD1 -4.32,-0.915; SHLD2 4.32,-0.915 | smd 1 x 2.1 bottom: SHLD3 -4.32,-0.915; SHLD4 4.32,-0.915 | smd 1 x 1.6: SHLD5 -4.32,-5.095; SHLD8 4.32,-5.095 | smd 1 x 1.6 bottom: SHLD6 -4.32,-5.095; SHLD7 4.32,-5.095 | hole 0.65: -2.89,-1.445; 2.89,-1.445
2X5-PTH-1.27MM = drill 0.508 pad 1: 1 -2.54,-0.635; 2 -2.54,0.635; 3 -1.27,-0.635; 4 -1.27,0.635; 5 0,-0.635; 6 0,0.635; 7 1.27,-0.635; 8 1.27,0.635; 9 2.54,-0.635; 10 2.54,0.635
1X08_SMD_COMBINED = smd 1 x 2: 1 0,1.65; 1@2 0,-1.65; 2 2.54,-1.65; 2@2 2.54,1.65; 3 5.08,1.65; 3@2 5.08,-1.65; 4 7.62,-1.65; 4@2 7.62,1.65; 5 10.16,1.65; 5@2 10.16,-1.65; 6 12.7,-1.65; 6@2 12.7,1.65; 7 15.24,1.65; 7@2 15.24,-1.65; 8 17.78,-1.65; 8@2 17.78,1.65
1X04_SMD_VERTICAL_COMBO = smd 1 x 2: 1 0,-1.65; 1-2 0,1.65; 2 2.54,1.65; 2-2 2.54,-1.65; 3 5.08,-1.65; 3-2 5.08,1.65; 4 7.62,1.65; 4-2 7.62,-1.65
JST04_1MM_RA = smd 0.6 x 1.35: 1 -1.5,0; 2 -0.5,0; 3 0.5,0; 4 1.5,0 | smd 1.2 x 2: NC1 2.8,-3.675; NC2 -2.8,-3.675
FPC-24-AMPHENOL-SFV24R-1STE1HLF = smd 0.3 x 1.4: 1 5.75,2.4; 2 5.25,2.4; 3 4.75,2.4; 4 4.25,2.4; 5 3.75,2.4; 6 3.25,2.4; 7 2.75,2.4; 8 2.25,2.4; 9 1.75,2.4; 10 1.25,2.4; 11 0.75,2.4; 12 0.25,2.4; 13 -0.25,2.4; 14 -0.75,2.4; 15 -1.25,2.4; 16 -1.75,2.4; 17 -2.25,2.4; 18 -2.75,2.4; 19 -3.25,2.4; 20 -3.75,2.4; 21 -4.25,2.4; 22 -4.75,2.4; 23 -5.25,2.4; 24 -5.75,2.4 | smd 1.4 x 1.6: MNT1@0 -8.15,1.5; MNT2@1 8.15,1.5 | smd 1.25 x 2.3: MNT1@1 -6.825,1.15; MNT2@0 6.825,1.15
1X08_NO_SILK = drill 1.016 pad 1.88: 1 0,0; 2 2.54,0; 3 5.08,0; 4 7.62,0; 5 10.16,0; 6 12.7,0; 7 15.24,0; 8 17.78,0
1X12_NO_SILK = drill 1.016 pad 1.88: 1 0,0; 2 2.54,0; 3 5.08,0; 4 7.62,0; 5 10.16,0; 6 12.7,0; 7 15.24,0; 8 17.78,0; 9 20.32,0; 10 22.86,0; 11 25.4,0; 12 27.94,0
SMT-JUMPER_2_NC_TRACE_SILK = smd 0.635 x 1.27: 1 -0.508,0; 2 0.508,0
DIPSWITCH-04-SMD = smd 1.27 x 2.54: 1 -3.81,4.445; 2 -1.27,4.445; 3 1.27,4.445; 4 3.81,4.445; 5 3.81,-4.445; 6 1.27,-4.445; 7 -1.27,-4.445; 8 -3.81,-4.445
TACTILE_SWITCH_SMD_4.6X2.8MM = smd 0.9 x 1: 1 -2.05,-0.8; 2 2.05,-0.8; 3 2.05,0.8; 4 -2.05,0.8
PAD.03X.05 = smd 1.27 x 1.27: P$1 0,0
QFN-32-NOPAD = smd 0.285 x 0.8: 1 -1.75,-2.5; 2 -1.25,-2.5; 3 -0.75,-2.5; 4 -0.25,-2.5; 5 0.25,-2.5; 6 0.75,-2.5; 7 1.25,-2.5; 8 1.75,-2.5; 17 1.75,2.5; 18 1.25,2.5; 19 0.75,2.5; 20 0.25,2.5; 21 -0.25,2.5; 22 -0.75,2.5; 23 -1.25,2.5; 24 -1.75,2.5 | smd 0.8 x 0.285: 9 2.5,-1.75; 10 2.5,-1.25; 11 2.5,-0.75; 12 2.5,-0.25; 13 2.5,0.25; 14 2.5,0.75; 15 2.5,1.25; 16 2.5,1.75; 25 -2.5,1.75; 26 -2.5,1.25; 27 -2.5,0.75; 28 -2.5,0.25; 29 -2.5,-0.25; 30 -2.5,-0.75; 31 -2.5,-1.25; 32 -2.5,-1.75
ARTEMIS_FP = smd 0.4 x 0.6: AD16 -4,-3.7; BOOT 1.5,4.5; D0 0.5,-4.5; D1 -0.5,-4.5; D2 -1,-3.7; D3 2,-3.7; D7 -1.5,4.5; D8 -0.5,4.5; D9 2,3.7; D10 1,3.7; D14 -5,3.7; D17 -3.5,-4.5; D36 2.5,-4.5; D38 3,-3.7; D40 2.5,4.5; D41 -2.5,-4.5; GND@1 4.5,4.5; GND@39 -5.5,-4.5; GND@47 -1.5,-4.5; GND@59 4.5,-4.5; RXI-0 3.5,4.5; SWDCK 4,3.7; SWDIO 0,3.7; TXO-0 0.5,4.5; ~AD31 -3,-3.7; ~AD35 -2,3.7; ~D4 -2.5,4.5; ~D5 -1,3.7; ~D18 -4.5,-4.5; ~D19 -5,-3.7; ~D22 -3.5,4.5; ~D23 -4,3.7; ~D24 -3,3.7; ~D27 -4.5,4.5; ~D28 -5.5,4.5; ~D37 3.5,-4.5; ~D39 3,3.7; ~D42 1.5,-4.5; ~D43 1,-3.7; ~D44 4,-3.7; ~D45 -2,-3.7; ~RST 0,-3.7 | smd 0.6 x 0.4: AD34 -6.5,-0.5; D15 -6.5,0.5; VDD@36 -5.7,-3; VDD@37 -6.5,-3.5; XI -6.5,-2.5; XO -5.7,-2; ~AD11 -5.7,-1; ~AD12 -5.7,2; ~AD13 -5.7,1; ~AD29 -6.5,-1.5; ~AD32 -5.7,3; ~AD33/SWO -5.7,0; ~D6 -6.5,3.5; ~D25 -6.5,2.5; ~D26 -6.5,1.5 | smd 0.6 x 0.6: GND@22 -6.5,4.5; GND@38 -6.5,-4.5
LGA-12-LISDH12 = smd 0.275 x 0.25: 1 -0.75,0.75; 2 -0.75,0.25; 3 -0.75,-0.25; 4 -0.75,-0.75; 7 0.75,-0.75; 8 0.75,-0.25; 9 0.75,0.25; 10 0.75,0.75 | smd 0.25 x 0.275: 5 -0.25,-0.75; 6 0.25,-0.75; 11 0.25,0.75; 12 -0.25,0.75
SOT23-5 = smd 0.55 x 1.2: 1 -0.95,-1.3; 2 0,-1.3; 3 0.95,-1.3; 4 0.95,1.3; 5 -0.95,1.3
CRYSTAL-SMD-2X2.5MM = smd 1.2 x 1.1: P1 0.846,0.69; P2 -0.854,0.69; P3 -0.854,-0.71; P4 0.846,-0.71
CRYSTAL-SMD-3.2X1.5MM = smd 1 x 1.8: P$1 -1.25,0; P$2 1.25,0

### Placement (x,y rotation side)
C1  36.2,15.88 270 top
C2  34.8,15.88 270 top
C3  33.4,15.88 270 top
C4  85.09,8.89 225 top
C5  8.89,13.72 180 top
C6  3.68,2.54 270 top
C7  8.89,15.11 180 top
C8  5.08,2.54 270 top
C9  10.16,2.54 270 top
C10  43.18,15.88 90 top
C11  38.1,15.88 90 top
C12  12.7,24.13 180 top
C13  12.7,16.51 180 top
C14  14.35,2.54 270 top
C15  11.3,28.83 90 top
C16  11.3,33.66 270 top
C17  12.7,33.66 270 top
C18  44.45,7.62 0 top
C19  44.45,12.7 180 top
D1  21.59,18.92 180 top
D2  21.59,20.32 180 top
D3  21.59,21.72 180 top
D4  21.59,24.13 180 top
D5  21.59,16.51 180 top
D6  9.27,20.32 0 top
E1  14.48,28.83 90 top
FD1  1.27,36.83 0 top
FD2  1.27,36.83 0 bottom
FD3  92.71,1.27 0 top
FD4  92.71,1.27 0 bottom
FRAME1  22.86,-12.7 0 top  (outside the outline)
J1  6.35,20.32 270 top
J2  21.59,30.48 270 top
J3  3.81,8.89 270 top
J4  86.36,33.02 270 top
J5  71.12,27.94 0 top
J6  5.08,31.75 270 top
J7  38.1,2.54 0 top
J8  92.07,33.02 270 top
J9  78.74,10.16 180 top
J10  50.8,27.94 0 top
J11  68.58,10.16 180 top
J12  90.17,33.02 270 top
J14  78.74,3.81 180 top
J22  50.8,34.29 0 top
J23  78.74,1.27 180 top
J24  50.8,36.83 0 top
J25  78.74,5.71 180 top
J26  50.8,32.38 0 top
JP1  16.89,1.52 0 top
LOGO1  83.18,5.08 45 top
LOGO2  9.52,19.68 270 bottom
R1  25.4,18.92 0 top
R2  25.4,20.32 0 top
R3  25.4,21.72 0 top
R4  25.4,24.13 0 top
R5  25.4,16.51 0 top
R6  8.89,16.51 0 top
R7  8.89,24.13 180 top
R11  2.29,2.54 90 top
R12  83.69,10.16 225 top
R13  21.59,0.89 0 top
R14  9.91,28.83 270 top
R15  9.91,33.66 90 top
R16  12.7,18.92 0 top
R17  12.7,20.32 0 top
R18  12.7,21.72 0 top
R19  11.56,2.54 270 top
R20  12.95,2.54 270 top
S1  21.59,7.62 90 top
S2  87.63,6.35 315 top
TP3  24.13,0.95 0 top
TP4  26.04,0.95 0 top
TP5  6.99,5.08 0 top
TP11  27.94,0.95 0 top
U1  10.16,8.89 180 top
U2  38.1,27.94 90 top
U3  15.37,33.66 90 top
U4  44.45,10.16 270 top
U$1  [RST6]  88.76,2.84 45 top
U$2  [GND0]  78.96,1.27 0 top
U$3  [GND0]  78.96,36.83 0 top
U$4  [GND2]  81.71,28.6 90 top
U$5  [3V34]  81.76,18.59 90 top
U$6  [1V85]  81.76,13.61 90 top
U$7  [VUSB5]  81.71,23.47 90 top
U$8  [390]  50.8,19.68 90 top
U$9  [401]  53.34,19.68 90 top
U$10  [442]  55.88,19.68 90 top
U$11  [373]  58.42,19.68 90 top
U$12  [384]  60.96,19.68 90 top
U$13  [365]  63.5,19.68 90 top
U$14  [426]  66.04,19.68 90 top
U$15  [437]  68.58,19.68 90 top
U$16  [458]  71.12,19.68 90 top
U$17  [419]  73.66,19.68 90 top
U$18  [3110]  76.2,19.68 90 top
U$19  [1611]  78.74,19.68 90 top
U$20  [2812]  50.8,13.34 90 top
U$21  [2513]  53.34,13.34 90 top
U$22  [2614]  55.88,13.34 90 top
U$23  [3415]  58.42,13.34 90 top
U$24  [2916]  60.96,13.34 90 top
U$25  [3217]  63.5,13.34 90 top
U$26  [3318]  66.04,13.34 90 top
U$27  [1319]  68.58,13.65 90 top
U$28  [2720]  71.12,13.65 90 top
U$29  [2321]  73.66,13.65 90 top
U$30  [3522]  76.2,13.65 90 top
U$31  [2423]  78.74,13.65 90 top
U$32  [QWIIC_6MM]  6.99,31.75 90 top
U$33  [SWD_TARGET7]  19.25,27.03 90 top
U$34  [SWD_INTFC8]  1.37,5.33 90 top
U$35  [CAMERA11]  35.56,6.67 0 top
U$36  [MIC9]  17.46,27.3 90 top
U$37  [ACC10]  17.46,32.07 90 top
U$38  [INTFC##TARGET12]  18.03,13.94 0 top
U$39  [PWR13]  14.92,24.13 0 top
U$40  [MSD16]  14.92,19.05 0 top
U$41  [HID15]  15.24,20.37 0 top
U$42  [COM14]  14.73,21.72 0 top
U$43  [STAT17]  14.76,16.48 0 top
U$45  [SFE_LOGO_FLAME_.2]  88.9,10.79 45 top
U$47  [ARTMBED17]  38.73,2.54 0 bottom
U$48  [390]  50.8,32.38 270 bottom
U$49  [401]  53.34,32.38 270 bottom
U$50  [442]  55.88,32.38 270 bottom
U$51  [373]  58.42,32.38 270 bottom
U$52  [384]  60.96,32.38 270 bottom
U$53  [365]  63.5,32.38 270 bottom
U$54  [426]  66.04,32.38 270 bottom
U$55  [437]  68.58,32.38 270 bottom
U$56  [458]  71.12,32.38 270 bottom
U$57  [419]  73.66,32.38 270 bottom
U$58  [3110]  76.2,32.38 270 bottom
U$59  [1611]  78.74,32.38 270 bottom
U$60  [2812]  50.8,10.79 270 bottom
U$61  [2513]  53.34,10.79 270 bottom
U$62  [2614]  55.88,10.79 270 bottom
U$63  [3415]  58.42,10.79 270 bottom
U$64  [2916]  60.96,10.79 270 bottom
U$65  [3217]  63.5,10.79 270 bottom
U$66  [3318]  66.04,10.79 270 bottom
U$67  [1319]  68.58,10.79 270 bottom
U$68  [2720]  71.12,10.79 270 bottom
U$69  [2321]  73.66,10.79 270 bottom
U$70  [3522]  76.2,10.79 270 bottom
U$71  [2423]  78.74,10.79 270 bottom
U$72  [GND1]  87.63,34.92 270 bottom
U$73  [1V83]  87.63,19.3 270 bottom
U$74  [3V32]  87.63,24.64 270 bottom
U$75  [VUSB4]  87.63,29.97 270 bottom
U$76  [ADC0]  47.62,24.77 0 bottom
U$77  [1319]  46.36,22.23 0 bottom
U$78  [1611]  46.36,20.32 0 bottom
U$79  [2916]  46.36,18.41 0 bottom
U$80  [3110]  46.36,16.51 0 bottom
U$81  [3217]  46.36,14.61 0 bottom
U$82  [3318]  46.36,12.7 0 bottom
U$83  [3415]  46.36,10.79 0 bottom
U$84  [3522]  46.36,8.89 0 bottom
U$85  [IOM21]  34.93,35.56 0 bottom
U$86  [IOM32]  28.57,35.56 0 bottom
U$87  [IOM43]  22.23,35.56 0 bottom
U$88  [SCL#SCLK4]  46.99,33.02 0 bottom
U$89  [SDA#MISO5]  46.99,30.48 0 bottom
U$90  [MOSI6]  41.91,27.94 0 bottom
U$91  [384]  27.3,27.94 0 bottom
U$92  [437]  27.3,30.48 0 bottom
U$93  [426]  27.3,33.02 0 bottom
U$94  [442]  20.32,27.94 0 bottom
U$95  [401]  20.32,30.48 0 bottom
U$96  [390]  20.32,33.02 0 bottom
U$97  [2720]  33.66,33.02 0 bottom
U$98  [2513]  33.66,30.48 0 bottom
U$99  [2812]  33.66,27.94 0 bottom
U$100  [PWM7]  40.64,24.77 0 bottom
U$101  [2321]  41.27,22.23 0 bottom
U$102  [TX9]  32.38,22.23 0 bottom
U$103  [RX10]  28.57,22.23 0 bottom
U$104  [UART18]  32.38,24.77 0 bottom
U$105  [2423]  41.27,20.32 0 bottom
U$106  [2513]  41.27,18.41 0 bottom
U$107  [2614]  41.27,16.51 0 bottom
U$108  [2720]  41.27,14.61 0 bottom
U$109  [2812]  41.27,12.7 0 bottom
U$110  [373]  41.27,10.79 0 bottom
U$111  [390]  41.27,8.89 0 bottom
U$112  [426]  41.27,6.99 0 bottom
U$113  [437]  36.83,22.23 0 bottom
U$114  [442]  36.83,20.32 0 bottom
U$115  [458]  36.83,18.41 0 bottom
U$116  [1319]  36.83,16.51 0 bottom
U$117  [2916]  36.83,14.61 0 bottom
U$118  [3110]  36.83,12.7 0 bottom
U$119  [3217]  36.83,10.79 0 bottom
U$120  [3318]  36.83,8.89 0 bottom
U$121  [3522]  36.83,6.99 0 bottom
U$122  [2513]  27.94,17.78 0 bottom
U$123  [365]  27.94,15.88 0 bottom
U$124  [373]  32.38,17.78 0 bottom
U$125  [384]  27.94,13.97 0 bottom
U$126  [390]  32.38,15.88 0 bottom
U$127  [401]  27.94,12.06 0 bottom
U$128  [426]  32.38,13.97 0 bottom
U$129  [437]  27.94,10.16 0 bottom
U$130  [1319]  27.94,19.68 0 bottom
U$131  [3522]  32.38,19.68 0 bottom
U$132  [RX10]  20.32,22.23 0 bottom
U$133  [1611]  24.13,19.68 0 bottom
U$134  [2916]  19.69,13.97 0 bottom
U$135  [3110]  19.69,12.06 0 bottom
U$136  [3415]  19.69,10.16 0 bottom
U$137  [2321]  19.69,19.68 0 bottom
U$138  [2614]  24.13,17.78 0 bottom
U$139  [UART011]  24.13,24.77 0 bottom
U$140  [TX9]  24.13,22.23 0 bottom
U$141  [2720]  19.69,17.78 0 bottom
U$142  [2812]  19.69,15.88 0 bottom
U$143  [390]  24.13,15.88 0 bottom
U$144  [401]  19.69,8.26 0 bottom
U$145  [442]  24.13,12.06 0 bottom
U$146  [419]  24.13,13.97 0 bottom
U$147  [458]  19.69,6.35 0 bottom
U$148  [GND0]  86.36,1.27 0 bottom
U$149  [GND0]  86.36,36.83 0 bottom
X1  7.62,2.54 90 top
Y1  40.64,15.88 0 top

### Tracks (layer width: path | path; a pad name or v marks a point on that pad's centre or on a via)
1.8V  (via drill 0.38)
  Top 0.203: J7.10 39.35,6.2 v39.2,6.35 | v45.72,10.16 45.75,10.19 U4.5
  Top 0.406: J4.7 J4.7@2 82.68,17.78 81.6,16.7 v81.6,15.24 J4.8 J4.8@2
  Top 0.508: C19.1 45.75,12.25 U4.5
  Top 0.61: J4.7 J12.7 | J4.8@2 J12.8
  Top 1.219: J12.8 J12.7 J8.7 J8.8 J12.8
  Bottom 0.203: v45.72,10.16 42.67,10.16 39.2,6.69 v39.2,6.35
  Bottom 0.406: v45.72,10.16 46.74,10.16 48.92,12.34 66.35,12.34 66.41,12.28 78.7,12.28 81.63,15.21 v81.6,15.24
  Bottom 1.219: J12.7 J8.7 J8.8 J12.8 J12.7
3.3V  (via drill 0.38)
  Top 0.203: U3.3 U3.2 U3.9 U3.10 12.8,34.41 C17.1 | U1.5 9.91,10.67 9.78,10.54 9.4,10.54 | 9.4,10.54 9.02,10.54 8.91,10.65 U1.7 8.91,12.89 C5.1 | U2.VDD@36 41.6,21.74 U2.VDD@37 | J7.11 38.85,3.82 38.86,3.81 v38.86,3.68 41.91,3.68 42.35,4.12 J7.4 | E1.5 13.15,29.73 11.4,27.98 C15.1 | 9.4,10.54 v9.4,10.29 9.4,8.76 8.27,7.64 U1.15 7,7.64 6.86,7.49 6.86,6.95 4.23,4.32 3.94,4.32 3.68,4.06 C6.1
  Top 0.406: R4.2 26.25,22.99 | 26.25,22.99 R3.2 R2.2 R1.2 28.45,16.73 C3.1 C2.1 C1.1 36.45,16.73 37.63,17.91 39.12,17.91 v39.37,17.65 | R11.2 C6.1 | C5.1 C7.1 v12.57,15.11 | U2.VDD@37 41.6,17.72 v41.53,17.65 | J4.5 J4.5@2 83.06,22.86 82.17,21.97 v82.17,20.32 J4.6 J4.6@2 | J2.1 20.96,34.92 20.19,35.69 12.95,35.69 12.7,35.43 C17.1 C16.1 R15.2 9.11,34.51 6.85,32.25 J6.2 4.06,32.25 3.81,32 3.81,28.19 4.03,27.98 R14.2 C15.1 12.45,26.84 v12.45,26.67 12.45,26.54 13.21,25.78 16.51,25.78 19.3,22.99 26.25,22.99 | U4.1 41.98,11.11 40.64,12.45 v40.64,15.88 | C18.1 43.56,7.58 v43.56,6.35 | v80.43,12.41 80.43,12.22 R12.2
  Top 0.508: C18.1 43.15,8.07 U4.3 44.13,9.21 44.45,9.53 44.45,10.79 44.13,11.11 U4.1
  Top 0.61: J4.5 J12.5 | J4.6@2 J12.6
  Top 1.219: J12.5 J12.6 J8.6 J8.5 J12.5
  Bottom 0.203: v9.4,10.29 8,10.29 5.97,12.32 4.06,12.32 J3.1
  Bottom 0.406: v41.53,17.65 40.64,17.65 | 40.64,17.65 v39.37,17.65 | v40.64,15.88 40.64,17.65 | 38.86,2.49 21.32,2.49 12.57,11.24 v12.57,15.11 12.57,26.54 v12.45,26.67 | 38.86,2.49 43.19,2.49 52.08,11.38 65.95,11.38 66.01,11.32 79.1,11.32 80.19,12.41 v80.43,12.41 81.31,12.41 82.35,13.45 82.35,20.14 v82.17,20.32 | 38.86,2.49 v38.86,3.68 41.53,6.35 v43.56,6.35
  Bottom 1.219: J12.5 J12.6 J8.6 J8.5 J12.5
!RST  (via drill 0.38)
  Top 0.203: R19.1 11.56,4.01 11.3,4.26 11.01,4.26 9.41,5.86 U1.19 9.41,7.03 9.89,7.5 v10.17,7.5 11.94,9.27 11.94,10.39 12.19,10.64 U1.32
  Top 0.406: R19.1 R20.1 C14.1
  Bottom 0.203: v10.17,7.5 9.02,6.35 J3.10
!TGT_RST  (via drill 0.38)
  Top 0.203: TP11.P$1 v27.94,3.49 27.62,3.81 S1.8 24.51,3.81 21.97,6.35 v21.97,10.41 | J2.10 24.13,27.94 v25.4,29.21 | U2.~RST 41.35,27.94 39.05,30.24 38.72,30.24 v37.85,31.11 | R12.1 84.36,10.7 | 84.36,10.7 85.56,9.49 C4.1 86.75,8.44 S2.4 S2.3 | v37.97,3.24 38.18,3.04 42.28,3.04 v42.67,3.43 | v81.36,13.88 84.36,10.89 84.36,10.7
  Bottom 0.203: J2.10 22.73,27.43 22.73,12.33 21.97,11.57 v21.97,10.41 | v25.4,29.21 25.91,29.72 25.91,32.16 26.4,32.65 26.94,32.65 26.95,32.64 36.32,32.64 v37.85,31.11 | v27.94,3.49 28.46,2.97 37.71,2.97 v37.97,3.24 | v42.67,3.43 43.45,3.43 51.88,11.86 66.15,11.86 66.21,11.8 78.9,11.8 80.99,13.88 v81.36,13.88
!TGT_RST!_IF
  Top 0.203: S1.1 15.75,3.81 14.91,4.64 11.23,4.64 10.41,5.46 U1.21
CAMERA_D0  (via drill 0.38)
  Top 0.203: J7.14 37.35,6.1 36.73,6.71 36.73,10.82 v37.08,11.18 | U2.D0 41.4,28.44 38.86,30.98 v38.86,31.11
  Bottom 0.203: v38.86,31.11 37.85,30.1 36.99,30.1 33.91,27.02 33.91,24.77 29.59,20.45 29.59,13.05 32.36,10.29 36.52,10.29 37.08,10.85 v37.08,11.18
CAMERA_D1  (via drill 0.38)
  Top 0.203: U2.D1 41.32,27.43 38.9,29.86 37.96,29.86 v36.71,31.1 | v40.2,11.11 40.2,10.63 42.23,8.6 42.23,6.6 42.85,5.99 J7.3
  Bottom 0.203: v36.71,31.1 36.71,30.36 35.56,29.21 35.15,29.21 33.53,27.59 33.53,24.93 29.21,20.61 29.21,12.89 32.2,9.91 36.68,9.91 37.33,10.55 39.64,10.55 v40.2,11.11
CAMERA_D2  (via drill 0.38)
  Top 0.203: J7.9 39.85,6.86 37.72,8.99 v37.72,9.91 | U2.D2 41.27,26.94 38.74,29.48 37.68,29.48 36.77,30.38 v35.78,30.38
  Bottom 0.203: v35.78,30.38 33.15,27.75 33.15,25.09 28.83,20.77 28.83,12.74 32.04,9.53 37.34,9.53 v37.72,9.91
CAMERA_D3  (via drill 0.38)
  Top 0.203: v39.88,31.11 41.05,29.94 U2.D3 | v39.5,11.81 39.5,10.79 41.85,8.44 J7.5
  Bottom 0.203: v39.88,31.11 38.48,29.72 37.15,29.72 34.29,26.86 34.29,24.61 29.97,20.3 29.97,13.21 32.51,10.67 35.66,10.67 36.82,11.82 39.48,11.82 v39.5,11.81
CAMERA_D4  (via drill 0.38)
  Top 0.203: U2.~D4 32.74,25.44 v32.38,25.79 | v37.47,8.12 38.35,7.23 J7.12
  Bottom 0.203: v32.38,25.79 30.73,25.79 27.3,22.36 27.3,11 29.93,8.37 37.21,8.37 v37.47,8.12
CAMERA_D5  (via drill 0.38)
  Top 0.203: U2.~D5 29.13,26.94 v28.97,26.78 | J7.20 34.35,6.17 33.21,7.31 29.54,7.31 v27.94,8.9
  Bottom 0.203: v28.97,26.78 28.97,25.11 26.54,22.68 26.54,10.3 v27.94,8.9
CAMERA_D6  (via drill 0.38)
  Top 0.203: v30.1,23.6 30.35,23.34 30.35,20.29 31.74,18.91 33.32,18.91 34.6,20.19 U2.~D6 | J7.19 34.85,6.21 31.53,9.53 v30.48,9.53
  Bottom 0.203: v30.1,23.6 29.72,23.6 28.07,21.94 28.07,11.94 v30.48,9.53
CAMERA_D7  (via drill 0.38)
  Top 0.203: U2.D7 30.17,26.44 v29.74,26.01 | J7.13 37.85,6.62 v37.38,7.09
  Bottom 0.203: v29.74,26.01 29.74,25.34 26.92,22.52 26.92,10.84 29.79,7.98 36.49,7.98 v37.38,7.09
CAMERA_HSYNC  (via drill 0.38)
  Top 0.203: U2.D17 41.02,24.44 38.54,26.92 v38.23,26.92 | v34.42,11.73 34.42,10.33 36.35,8.4 J7.16 | v38.23,26.92
  Bottom 0.203: v38.23,26.92 38.22,26.92 31.12,19.82 31.12,13.68 32.18,12.62 33.53,12.62 v34.42,11.73
CAMERA_INT  (via drill 0.38)
  Top 0.203: U2.D10 30.5,28.94 v30.23,29.21 | v34.8,7.24 35.35,6.69 J7.18
  Bottom 0.203: v30.23,29.21 28.32,27.31 28.32,25 26.16,22.84 26.16,9.76 27.68,8.24 28.98,8.24 30.24,6.99 34.54,6.99 v34.8,7.24
CAMERA_MCLK  (via drill 0.38)
  Top 0.203: U2.~D18 41.41,23.44 38.7,26.15 37.95,26.15 37.36,26.73 v37.36,27.33 | J7.8 40.35,6.9 38.42,8.83 38.42,11.11 37.59,11.94 35.66,11.94 v35.43,11.71
  Bottom 0.203: v37.36,27.33 37.36,26.61 30.73,19.98 30.73,13.53 32.02,12.24 32.99,12.24 34.15,11.08 34.8,11.08 v35.43,11.71
CAMERA_PCLK  (via drill 0.38)
  Top 0.203: J7.17 35.85,8.36 v32.89,11.32 | U2.~D19 41.29,22.94 38.47,25.77 37.79,25.77 v36.39,27.16
  Bottom 0.203: v36.39,27.16 36.39,26.17 30.35,20.14 30.35,13.37 32.41,11.32 v32.89,11.32
CAMERA_TRIG  (via drill 0.38)
  Top 0.203: v39.62,8.64 40.85,7.41 J7.7 | v30.86,24.38 32.64,24.38 33.02,24 33.02,23.12 33.2,22.94 U2.D14
  Bottom 0.203: v30.86,24.38 29.97,24.38 27.69,22.1 27.69,11.25 30.17,8.76 39.5,8.76 v39.62,8.64
CAMERA_VSYNC  (via drill 0.38)
  Top 0.203: U2.D15 37.6,21.34 36.98,20.73 36.98,19.81 36.91,19.74 36.91,19.73 35.21,18.03 31.47,18.03 29.21,20.29 v29.21,22.1 | v39.5,9.78 41.35,7.93 J7.6
  Bottom 0.203: v29.21,22.1 28.45,21.34 28.45,12.58 31.88,9.14 38.86,9.14 v39.5,9.78
D13  (via drill 0.38)
  Top 0.203: U2.~AD13 38.62,23.76 v39.1,23.76 | v43.43,19.43 45.59,17.27 67.94,17.27 68.58,16.64 J11.1@2
  Top 0.406: J11.1 J11.1@2
  Top 0.61: J11.1 J25.5
  Top 1.219: J25.5 J14.5
  Bottom 0.203: v39.1,23.76 40.5,23.76 43.43,20.83 v43.43,19.43
D16
  Top 0.203: J5.4-2 78.74,20.07 77.98,19.3 47.75,19.3 43.12,23.94 U2.AD16
  Top 0.406: J5.4 J5.4-2
  Top 0.61: J5.4 J26.12
  Top 1.219: J22.12 J26.12
D23_LED  (via drill 0.38)
  Top 0.203: U2.~D23 35.31,23.94 36.36,24.99 37.72,24.99 v37.84,25.12 | v44.96,19.43 44.96,19.18 46.1,18.03 73.02,18.03 73.66,17.4 v73.66,13.46 J9.3 | v32.26,13.52 29.24,13.52 R5.2
  Top 0.406: J9.3-2 J9.3
  Top 0.61: J9.3-2 J25.3
  Top 1.219: J25.3 J14.3
  Bottom 0.203: v37.84,25.12 40.22,25.12 44.96,20.38 v44.96,19.43 | v32.26,13.52 34.49,13.52 35.18,12.83 66.55,12.83 66.61,12.76 72.96,12.76 v73.66,13.46
D24  (via drill 0.38)
  Top 0.203: v38.48,28.76 37.8,28.07 36.23,28.07 35.72,27.56 35.72,25.81 34.85,24.94 U2.~D24 | J9.1 78.74,18.03 77.98,18.8 46.86,18.8 46.48,19.18 v46.48,19.43
  Top 0.406: J9.1-2 J9.1
  Top 0.61: J9.1-2 J25.1
  Top 1.219: J25.1 J14.1
  Bottom 0.203: v46.48,19.43 46.48,20.32 46.04,20.76 45.66,20.76 40.54,25.88 39.67,25.88 39.26,26.29 39.26,27.45 38.48,28.23 v38.48,28.76
D25  (via drill 0.38)
  Top 0.203: U2.~D25 35,20.84 v35,19.44 | v48.76,14.24 49.02,14.5 49.02,14.51 49.5,14.99 52.7,14.99 53.34,14.35 J11.7@2
  Top 0.406: J11.7@2 J11.7
  Top 0.61: J11.7 J25.11
  Top 1.219: J25.11 J14.11
  Bottom 0.203: v35,19.44 35,15.42 36.45,13.97 48.49,13.97 v48.76,14.24
D26  (via drill 0.38)
  Top 0.203: U2.~D26 36.6,20.34 v36.32,20.07 | v47.84,14.62 48.59,15.37 55.24,15.37 55.88,14.73 J11.6
  Top 0.406: J11.6 J11.6@2
  Top 0.61: J11.6@2 J25.10
  Top 1.219: J25.10 J14.10
  Bottom 0.203: v36.32,20.07 36.32,14.64 36.61,14.35 47.58,14.35 v47.84,14.62
D27  (via drill 0.38)
  Top 0.203: v38.48,24.43 36.34,24.43 35.34,23.44 U2.~D27 | v44.2,20.07 44.2,19.25 45.79,17.65 70.48,17.65 71.12,17.02 J9.4-2
  Top 0.406: J9.4 J9.4-2
  Top 0.61: J9.4 J25.4
  Top 1.219: J25.4 J14.4
  Bottom 0.203: v38.48,24.43 40.37,24.43 44.2,20.61 v44.2,20.07
D28  (via drill 0.38)
  Top 0.203: U2.~D28 33.11,22.44 32.64,21.97 32.64,19.81 v32.38,19.56 | J11.8 50.8,13.97 50.16,14.61 49.66,14.61 49.4,14.35 v49.4,13.59
  Top 0.406: J11.8 J11.8@2
  Top 0.61: J11.8@2 J25.12
  Top 1.219: J25.12 J14.12
  Bottom 0.203: v49.4,13.59 36.2,13.59 32.38,17.4 v32.38,19.56
D29  (via drill 0.38)
  Top 0.203: U2.~AD29 39.6,20.09 v39.45,19.94 | v46.02,15.38 46.4,15.38 47.15,16.13 60.33,16.13 60.96,15.49 J11.4
  Top 0.406: J11.4 J11.4@2
  Top 0.61: J11.4@2 J25.8
  Top 1.219: J25.8 J14.8
  Bottom 0.203: v39.45,19.94 38.24,18.73 38.24,16.02 39.15,15.11 45.75,15.11 v46.02,15.38
D31
  Top 0.203: J5.3 76.2,20.32 75.56,19.68 48.29,19.68 43.04,24.94 U2.~AD31
  Top 0.406: J5.3-2 J5.3
  Top 0.61: J5.3-2 J26.11
  Top 1.219: J22.11 J26.11
D32  (via drill 0.38)
  Top 0.203: U2.~AD32 36.65,23.79 v37.72,23.79 | v45.11,15.76 45.86,16.51 62.87,16.51 63.5,15.88 J11.3@2
  Top 0.406: J11.3@2 J11.3
  Top 0.61: J11.3 J25.7
  Top 1.219: J25.7 J14.7
  Bottom 0.203: v45.11,15.76 37.72,23.15 v37.72,23.79
D33  (via drill 0.38)
  Top 0.203: U2.~AD33/SWO 38.95,23.09 v40.23,23.09 | v45.09,16.76 45.57,16.76 45.7,16.89 65.4,16.89 66.04,16.26 J11.2
  Top 0.406: J11.2 J11.2@2
  Top 0.61: J11.2@2 J25.6
  Top 1.219: J25.6 J14.6
  Bottom 0.203: v45.09,16.76 40.23,21.62 v40.23,23.09
D34  (via drill 0.38)
  Top 0.203: U2.AD34 38.6,21.3 37.86,20.56 v37.86,20.43 | v46.93,15 47.31,15 48.06,15.75 57.79,15.75 58.42,15.11 J11.5@2
  Top 0.406: J11.5@2 J11.5
  Top 0.61: J11.5 J25.9
  Top 1.219: J25.9 J14.9
  Bottom 0.203: v37.86,20.43 37.86,15.86 38.99,14.73 46.66,14.73 v46.93,15
D35  (via drill 0.38)
  Top 0.203: v37.39,28.78 36.27,28.78 35.34,27.84 35.34,26.35 34.93,25.94 U2.~AD35 | v45.72,20.07 45.72,19.13 46.43,18.41 75.56,18.41 76.2,17.78 J9.2-2
  Top 0.406: J9.2 J9.2-2
  Top 0.61: J9.2 J25.2
  Top 1.219: J25.2 J14.2
  Bottom 0.203: v45.72,20.07 45.77,20.11 40.38,25.5 39.37,25.5 38.88,25.99 38.88,27.3 v37.39,28.78
D36
  Top 0.203: U2.D36 43.18,30.44 44.19,29.43 44.19,26.48 49.08,21.59 62.87,21.59 63.5,22.23 J10.6
  Top 0.406: J10.6@2 J10.6
  Top 0.61: J10.6@2 J26.6
  Top 1.219: J22.6 J26.6
D37
  Top 0.203: J10.4 58.42,22.99 57.79,22.35 49.4,22.35 44.95,26.8 44.95,29.75 43.26,31.44 U2.~D37
  Top 0.406: J10.4@2 J10.4
  Top 0.61: J10.4@2 J26.4
  Top 1.219: J22.4 J26.4
D38
  Top 0.203: J10.5@2 60.96,22.61 60.33,21.97 49.24,21.97 44.57,26.64 44.57,29.59 43.22,30.94 U2.D38
  Top 0.406: J10.5 J10.5@2
  Top 0.61: J10.5 J26.5
  Top 1.219: J22.5 J26.5
D39  (via drill 0.38)
  Top 0.203: U2.~D39 35.72,32.26 v40.89,32.26 | v45.98,29.34 46.1,29.34 46.86,28.57 46.86,26.5 49.87,23.5 50.16,23.5 50.8,24.13 J10.1@2
  Top 0.406: J10.1 J10.1@2
  Top 0.61: J10.1 J26.1
  Top 1.219: J22.1 J26.1
  Bottom 0.203: v40.89,32.26 41.16,31.99 41.66,31.5 41.66,31.24 44.2,28.7 45.34,28.7 v45.98,29.34
D40  (via drill 0.38)
  Top 0.203: U2.D40 34.93,30.44 36.36,31.88 40.36,31.88 40.63,31.61 v40.89,31.34 | J10.2 53.34,23.75 52.7,23.11 49.71,23.11 46.1,26.72 v46.1,28.32
  Top 0.406: J10.2@2 J10.2
  Top 0.61: J10.2@2 J26.2
  Top 1.219: J22.2 J26.2
  Bottom 0.203: v40.89,31.34 43.92,28.32 v46.1,28.32
D41
  Top 0.203: J5.2-2 73.66,20.7 73.02,20.07 48.45,20.07 43.08,25.44 U2.D41
  Top 0.406: J5.2 J5.2-2
  Top 0.61: J5.2 J26.10
  Top 1.219: J22.10 J26.10
D42
  Top 0.203: U2.~D42 42.62,29.46 43.2,29.46 43.81,28.85 43.81,26.32 48.92,21.21 65.4,21.21 66.04,21.84 J10.7@2
  Top 0.406: J10.7 J10.7@2
  Top 0.61: J10.7 J26.7
  Top 1.219: J22.7 J26.7
D43
  Top 0.203: J10.8 68.58,21.46 67.94,20.83 48.76,20.83 43.43,26.17 43.43,28.69 43.18,28.94 U2.~D43
  Top 0.406: J10.8@2 J10.8
  Top 0.61: J10.8@2 J26.8
  Top 1.219: J22.8 J26.8
D44
  Top 0.203: J10.3@2 55.88,23.37 55.24,22.73 49.55,22.73 45.33,26.95 45.33,29.91 43.3,31.94 U2.~D44
  Top 0.406: J10.3 J10.3@2
  Top 0.61: J10.3 J26.3
  Top 1.219: J22.3 J26.3
D45
  Top 0.203: J5.1 71.12,21.08 70.48,20.45 48.61,20.45 43.11,25.94 U2.~D45
  Top 0.406: J5.1-2 J5.1
  Top 0.61: J5.1-2 J26.9
  Top 1.219: J22.9 J26.9
GND  (via drill 0.38)
  Top 0.203: U3.8 U3.7 U3.6 U3.5 | X1.P4 8.33,4.52 v8.38,4.57 | v17.27,27.56 14.55,27.56 E1.2 14.83,28.58 E1.8 | U1.8 8.41,13.35 C5.2 | E1.8 E1.7 E1.3 E1.6 E1.8 | U2.GND@47 40.49,26.44 v40.13,26.8
  Top 0.254: D6.2 v7.75,20.32
  Top 0.406: R20.2 C14.2 | C6.2 C8.2 X1.P2 | C5.2 C7.2 R6.1 7.45,17.09 J1.GND2 | C1.2 C2.2 C3.2 | U2.GND@39 U2.GND@38 42.6,20.38 v42.55,20.32 | U2.GND@22 33.6,20.14 v33.4,19.94
  Top 1.219: J24.1 J24.2 J24.3 J24.4 J24.5 J24.6 J24.7 J24.8 J24.9 J24.10 J24.11 J24.12 | J23.12 J23.11 J23.10 J23.9 J23.8 J23.7 J23.6 J23.5 J23.4 J23.3 J23.2 J23.1 | J12.1 J8.1 J8.2 J12.2 J12.1
  Bottom 1.219: J12.1 J8.1 J8.2 J12.2 J12.1
  other vias: 13.84,33.66 12.37,30.07 16.64,15.88 17.91,17.14 19.81,15.24 17.65,12.95 47.37,9.4 49.4,11.43 49.78,6.99 47.75,4.83 44.96,6.1 20.83,4.32 21.72,3.43 2.29,35.88 0.76,25.91 7.62,26.67 8.25,36.2 26.04,36.2 10.8,10.03 5.72,4.57 10.29,9.02 11.81,17.78 13.59,17.78 32.13,15.75 32.13,14.73 11.68,22.86 13.72,22.86 11.68,25.4 17.78,26.04 19.3,24.38 18.67,22.1 16.13,24.77 3.43,33.27 44.07,32.51 44.83,1.78 24.13,5.46 16,10.16 7.62,12.19 7.24,22.35 91.44,35.56 86.36,2.54 80.52,15.37 79.5,14.35 29.97,0.89 28.07,5.08 29.08,33.53 46.61,33.27 52.45,14.1 50.04,24.51 52.45,24 54.99,23.62 60.07,22.86 57.53,23.24 62.61,22.48 65.15,22.1 67.69,21.72 70.23,21.34 72.77,20.95 75.31,20.57 77.85,20.19 78.74,19.05 54.99,14.48 60.07,15.24 57.53,14.86 62.61,15.62 65.15,16 67.69,16.38 70.23,16.76 72.77,17.14 75.31,17.53 77.85,17.91 81.28,35.56 83.82,34.29 86.36,35.56 81.28,33.02 83.82,31.75 81.28,30.48 83.82,29.21 81.28,27.94 83.82,26.67 81.28,25.4 83.82,24.13 81.28,22.86 86.36,12.7 91.44,12.7 88.9,11.43 91.44,10.16 88.9,8.89 91.44,7.62 91.44,5.08 91.44,2.54 85.09,5.08 82.55,5.08 83.82,2.54 81.28,2.54 81.28,7.62 21.08,11.18 9.52,22.35 0.76,17.27 0.76,23.37 21.59,17.65 81.28,17.78 88.9,13.97 88.9,19.05 88.9,24.13 88.9,26.67 88.9,29.21 83.82,21.59 88.9,21.59 88.9,31.75 83.82,36.83 88.9,36.83 88.9,34.29 19.05,0.89 1.02,1.02
  pour Top (isolate 0.203): 0,38.1 25.4,38.1 30.48,33.02 45.72,33.02 50.8,38.1 93.98,38.1 93.98,0 0,0
  pour Bottom (isolate 0.203): 0,38.1 25.4,38.1 30.48,33.02 45.72,33.02 50.8,38.1 93.98,38.1 93.98,0 0,0
LED_HID
  Top 0.203: U1.30 14.09,9.64 14.48,10.03 14.48,11.71 19.3,16.54 19.3,19.56 20.07,20.32 D2.C
LED_MSD
  Top 0.203: U1.29 14.35,9.14 14.86,9.65 14.86,11.56 19.69,16.38 19.69,17.65 20.19,18.16 20.57,18.16 20.71,18.3 D1.C
LED_UART
  Top 0.203: U1.31 13.82,10.14 14.1,10.41 14.1,11.87 18.92,16.7 18.92,20.83 19.81,21.72 D3.C
N$1
  Top 0.406: R1.1 D1.A
N$2
  Top 0.406: D2.A R2.1
N$3
  Top 0.406: R3.1 D3.A
N$4
  Top 0.305: R6.2 9.74,17.82 8.99,18.57 J1.B5
N$5
  Top 0.305: J1.A5 7.73,21.57 8.04,21.88 R7.2
N$6
  Top 0.406: D5.A R5.1
N$7
  Top 0.406: D4.A R4.1
N$8
  Top 0.254: D6.4 10.28,19.82 11.18,18.92 R16.1
N$9
  Top 0.254: D6.6 10.28,20.82 11.18,21.72 R18.1
N$10
  Top 0.203: R11.1 1.61,1.69 1.4,1.91 1.4,3.95 1.67,4.22 1.68,4.22 1.78,4.32 3.4,4.32 3.78,4.7 4.06,4.7 6.48,7.11 6.48,7.65 6.97,8.14 U1.14
N$11  (via drill 0.38)
  Top 0.203: U1.23 11.41,7.6 v11.56,7.75 | JP1.1 15.75,1.52 v15.49,1.27
  Bottom 0.203: v15.49,1.27 12.07,1.27 11.56,1.78 v11.56,7.75
N$12
  Top 0.203: U1.28 14.61,8.64 15.24,9.27 15.24,11.05 15.62,11.43 S1.4
N$13
  Top 0.203: C8.1 X1.P1 6.93,5.03 TP5.P$1 7.75,5.08 8.41,5.74 U1.17
N$14
  Top 0.203: Y1.P$2 41.89,16.26 40.6,17.55 U2.XI
  Top 0.406: C10.2 42.36,16.73 41.89,16.26
N$15
  Top 0.203: Y1.P$1 39.39,16.26 40.1,16.97 U2.XO
  Top 0.406: Y1.P$1 39.39,16.2 38.86,16.73 C11.2
N$16
  Top 0.203: X1.P3 9.05,1.69 9.27,1.91 9.27,3.43 | 9.27,3.43 9.27,4.6 8.91,4.96 U1.18 | C9.1 9.31,3.39 9.27,3.43
N$17
  Top 0.203: S1.3 15.49,8.89 14.74,8.14 U1.27
N$18
  Top 0.203: S1.2 14.61,6.35 13.32,7.64 U1.26
PDM_CLK
  Top 0.203: E1.4 14.55,30.1 15.88,30.1 20.07,25.91 26.67,25.91 29.96,22.62 29.96,20.08 31.62,18.41 35.05,18.41 35.67,19.04 35.67,20.53 36.1,20.95 U2.~AD12
PDM_DATA
  Top 0.203: E1.1 13.18,27.85 14.12,26.91 18.52,26.91 19.91,25.53 26.51,25.53 27.99,24.05 27.99,20.91 31.26,17.64 36.24,17.64 39.1,20.5 U2.~AD11
SCL  (via drill 0.38)
  Top 0.203: J6.4 5.46,30.25 6.03,29.68 R14.1 9.91,30.35 10.29,30.73 v13.84,30.73 15.78,30.73 20.22,26.29 25.77,26.29 v26.16,26.68 | U3.1 14.62,32.55 14.22,32.15 v13.84,32.15 | J7.21 33.85,6.01 33.25,6.6 29.7,6.6 28.88,7.42 v28.5,7.42 | U2.D8 28.57,27.44 v27.94,28.07
  Bottom 0.203: v13.84,32.15 v13.84,30.73 | v27.94,28.07 27.55,28.07 v26.16,26.68 25.78,26.3 25.78,9.4 27.76,7.42 v28.5,7.42
SDA  (via drill 0.38)
  Top 0.203: U2.D9 32.72,29.94 v32.36,30.3 | 15.55,31.5 13.08,31.5 12.83,31.25 9.91,31.25 | 15.55,31.5 20.38,26.67 24.89,26.67 v25.78,27.56 | 15.55,31.5 16.12,32.07 U3.4 | J7.22 33.35,5.97 33.1,6.22 28.7,6.22 27.3,7.62 v26.16,7.62 | J6.3 9.91,31.25 | R15.1 9.91,31.25
  Bottom 0.203: v26.16,7.62 25.4,8.38 25.4,27.18 v25.78,27.56 28.52,30.3 v32.36,30.3
TCLK
  Top 0.203: J3.4 7.64,10.16 U1.10
TDI
  Top 0.203: U1.11 5.83,9.64 5.48,9.29 5.48,8.65 J3.8
TDO  (via drill 0.38)
  Top 0.203: U1.12 6.45,9.14 v6.24,8.93
  Bottom 0.203: J3.6 4.49,8.93 v6.24,8.93
TGT_BOOT  (via drill 0.38)
  Top 0.203: U2.BOOT 30.99,29.44 29.37,31.06 26.22,31.06 24.77,32.51 v24,32.51 | v19.9,9.18 20.03,9.05 20.03,7.87 20.05,7.85 20.05,7.58 20.66,6.97 20.68,6.97 20.83,6.83 20.83,6.13 | 20.83,6.13 20.03,5.33 20.03,3.65 17.91,1.52 JP1.2 | 20.83,6.13 20.83,5.88 22.44,4.26 R13.2
  Bottom 0.203: v24,32.51 24.26,32.26 24.26,9.78 23.24,8.76 22.23,8.76 21.32,9.66 20.39,9.66 v19.9,9.18
TGT_RX  (via drill 0.38)
  Top 0.203: U1.25 13.15,7.14 14.85,5.44 18.53,5.44 18.69,5.6 18.69,9.42 19.69,10.41 20.57,10.41 21.59,9.4 21.59,8.51 v21.08,8 21.59,7.49 21.59,6.19 24.49,3.3 24.49,2.5 TP4.P$1 | v26.67,32 27.23,31.44 U2.RXI-0
  Bottom 0.203: v26.67,32 26.29,31.62 26.29,29.08 25.02,27.81 25.02,9.3 23.72,8 v21.08,8
TGT_SWCLK  (via drill 0.38)
  Top 0.203: S1.7 24,6.35 22.86,7.49 v22.86,9.53 | U2.SWDCK 27.94,31.94 26.48,33.4 23.88,33.4 J2.4
  Bottom 0.203: J2.4 23.5,30.48 23.5,11.26 22.86,10.63 v22.86,9.53
TGT_SWDIO  (via drill 0.38)
  Top 0.203: v23.55,10.29 23.55,9.6 24.26,8.89 S1.6 | v23.5,31.75 23.5,30.73 23.93,30.3 26.8,30.3 29.15,27.94 U2.SWDIO
  Bottom 0.203: v23.55,10.29 23.88,10.62 23.88,31.37 v23.5,31.75 J2.2
TGT_SWO  (via drill 0.38)
  Top 0.203: v22.75,11.43 S1.5 | J2.6 22.79,29.91 25.61,29.91 26.05,29.48 26.05,28.59 29.58,25.06 32.98,25.06 U2.~D22
  Bottom 0.203: J2.6 23.11,29.59 23.11,11.8 v22.75,11.43
TGT_TX  (via drill 0.38)
  Top 0.203: U1.24 11.91,5.49 12.34,5.05 18.69,5.05 19.07,5.44 19.07,9.27 19.84,10.03 20.19,10.03 20.8,9.42 v20.8,8.91 20.43,8.55 20.43,7.73 20.81,7.35 20.84,7.35 21.21,6.99 21.21,6.03 24.11,3.14 24.11,0.98 TP3.P$1 | v24.91,30.99 25.21,30.68 26.96,30.68 29.19,28.44 U2.TXO-0
  Bottom 0.203: v24.91,30.99 24.64,30.72 24.64,9.46 23.56,8.38 22.07,8.38 21.53,8.91 v20.8,8.91
TMS  (via drill 0.38)
  Top 0.203: U1.13 8.26,8.64 v8.64,9.02
  Bottom 0.203: v8.64,9.02 6.22,11.43 J3.2
USB_D+_P  (via drill 0.38)
  Top 0.203: R16.2 15.24,18.92 v15.49,18.67 | U1.3 10.91,11.93 11.18,12.19 13.84,12.19 15.78,14.13 15.78,16.92 v16.13,17.27
  Bottom 0.203: v15.49,18.67 16.13,18.03 v16.13,17.27
USB_D+_R
  Top 0.254: D6.3 8.64,19.82 8.39,19.57 J1.B6
  Top 0.305: J1.A6 5.33,20.57 5.16,20.4 5.16,19.74 5.32,19.57 J1.B6
USB_D-_P
  Top 0.203: R18.2 14.61,21.72 16.19,20.13 16.19,18.35 15.4,17.56 15.4,14.29 13.69,12.57 11.02,12.57 10.41,11.96 U1.4
USB_D-_R
  Top 0.254: D6.1 8.64,20.82 8.39,21.07 6.86,21.07 | 6.86,21.07 J1.B7 | J1.A7 6.74,20.07 6.86,20.19 6.86,21.07
VBUS_IF  (via drill 0.38)
  Top 0.254: D6.5 v10.73,20.32 R17.1
  Top 0.406: J1.VBUS1 5.52,22.77 4.62,21.87 4.62,18.77 5.52,17.87 J1.VBUS2 v7.11,17.87 | J4.3@2 83.44,27.94 82.93,27.43 v82.93,25.4 J4.4
  Top 0.61: J4.4@2 J12.4 | J4.3 J12.3
  Top 1.219: J12.3 J12.4 J8.4 J8.3 J12.3
  Bottom 0.406: v7.11,17.87 8.28,17.87 v10.73,20.32 10.73,12.26 21.08,1.91 43.43,1.91 52.32,10.79 65.71,10.79 65.77,10.73 80.46,10.73 82.93,13.21 v82.93,25.4 J12.4
  Bottom 1.219: J12.3 J8.3 J8.4 J12.4 J12.3
VBUS_IF2  (via drill 0.38)
  Top 0.203: v14.73,16.51 15.02,16.22 15.02,14.45 13.53,12.95 10.41,12.95 v9.84,12.38 9.41,11.95 U1.6 | R19.2 11.56,2.29 11.81,2.54 18.18,2.54 19.52,3.89 19.52,6.06 v19.94,6.48
  Top 0.254: R17.2 v14.73,20.32
  Top 0.406: C12.1 v14.73,24.13 | C13.1 v14.73,16.51
  Bottom 0.203: v19.94,6.48 18.02,6.48 14.73,9.76 v14.73,16.51
  Bottom 0.406: v14.73,24.13 v14.73,20.32 v14.73,16.51

### Text on the board
Top: v02
tDocu: Owen Lyke, Kyle Wenner